# EAGLE schematic dacqs_host_board (EAGLE 7.7.0)

## Sheet 1 of 10
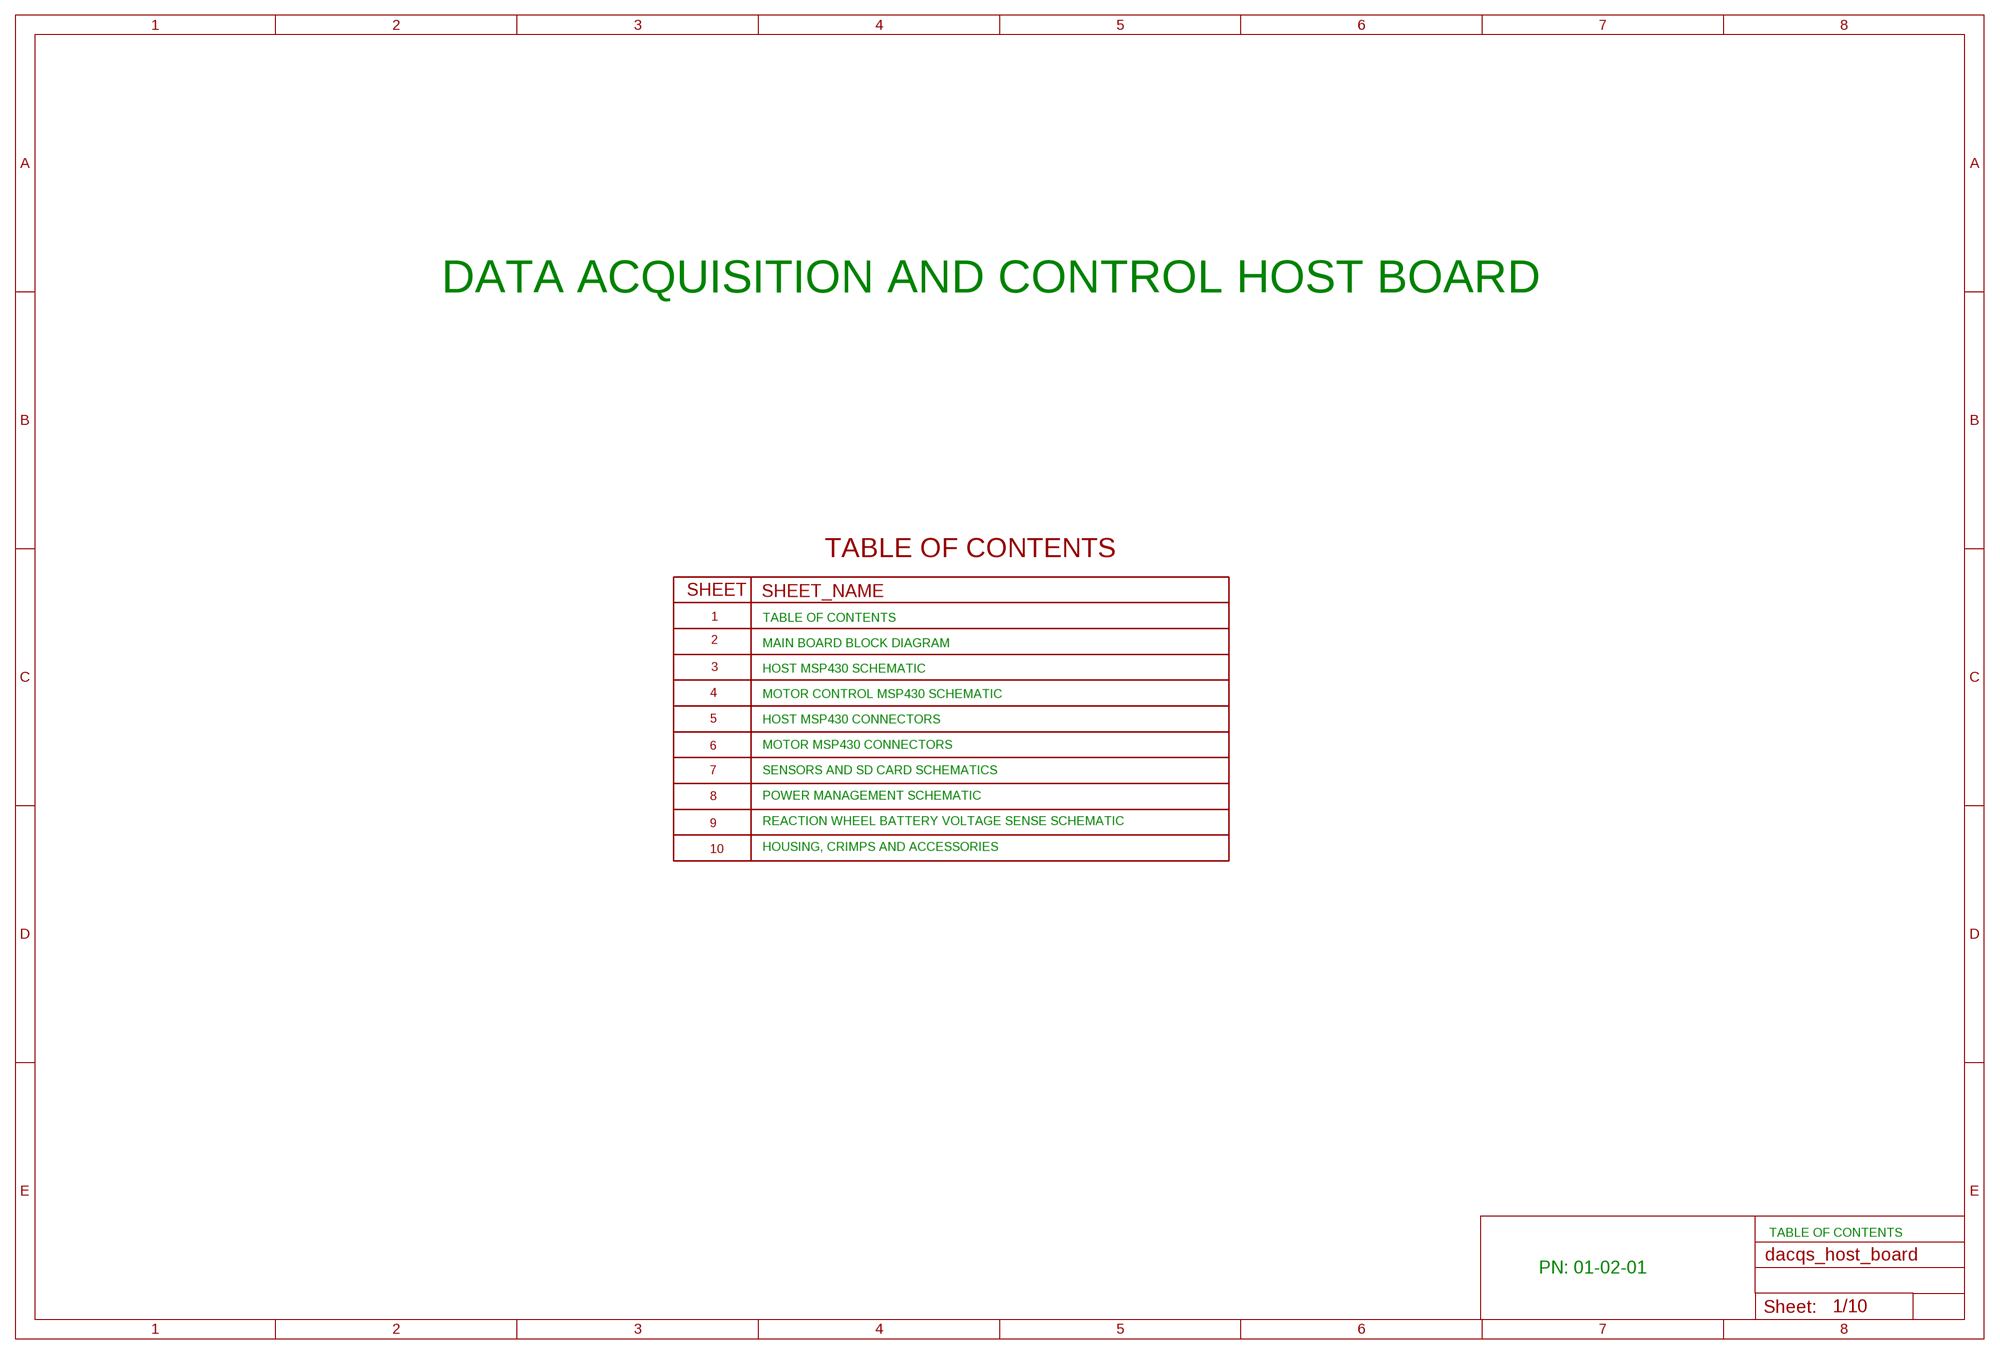
[diagram p0: schematic, sheet 1]
U$2 (TOC): VALUE: TOC

### Notes on the sheet
- DATA ACQUISITION AND CONTROL HOST BOARD
- TABLE OF CONTENTS
- MAIN BOARD BLOCK DIAGRAM
- HOST MSP430 SCHEMATIC
- MOTOR CONTROL MSP430 SCHEMATIC
- HOST MSP430 CONNECTORS
- MOTOR MSP430 CONNECTORS
- SENSORS AND SD CARD SCHEMATICS
- POWER MANAGEMENT SCHEMATIC
- REACTION WHEEL BATTERY VOLTAGE SENSE SCHEMATIC
- HOUSING, CRIMPS AND ACCESSORIES
- TABLE OF CONTENTS
- PN: 01-02-01

## Sheet 2 of 10
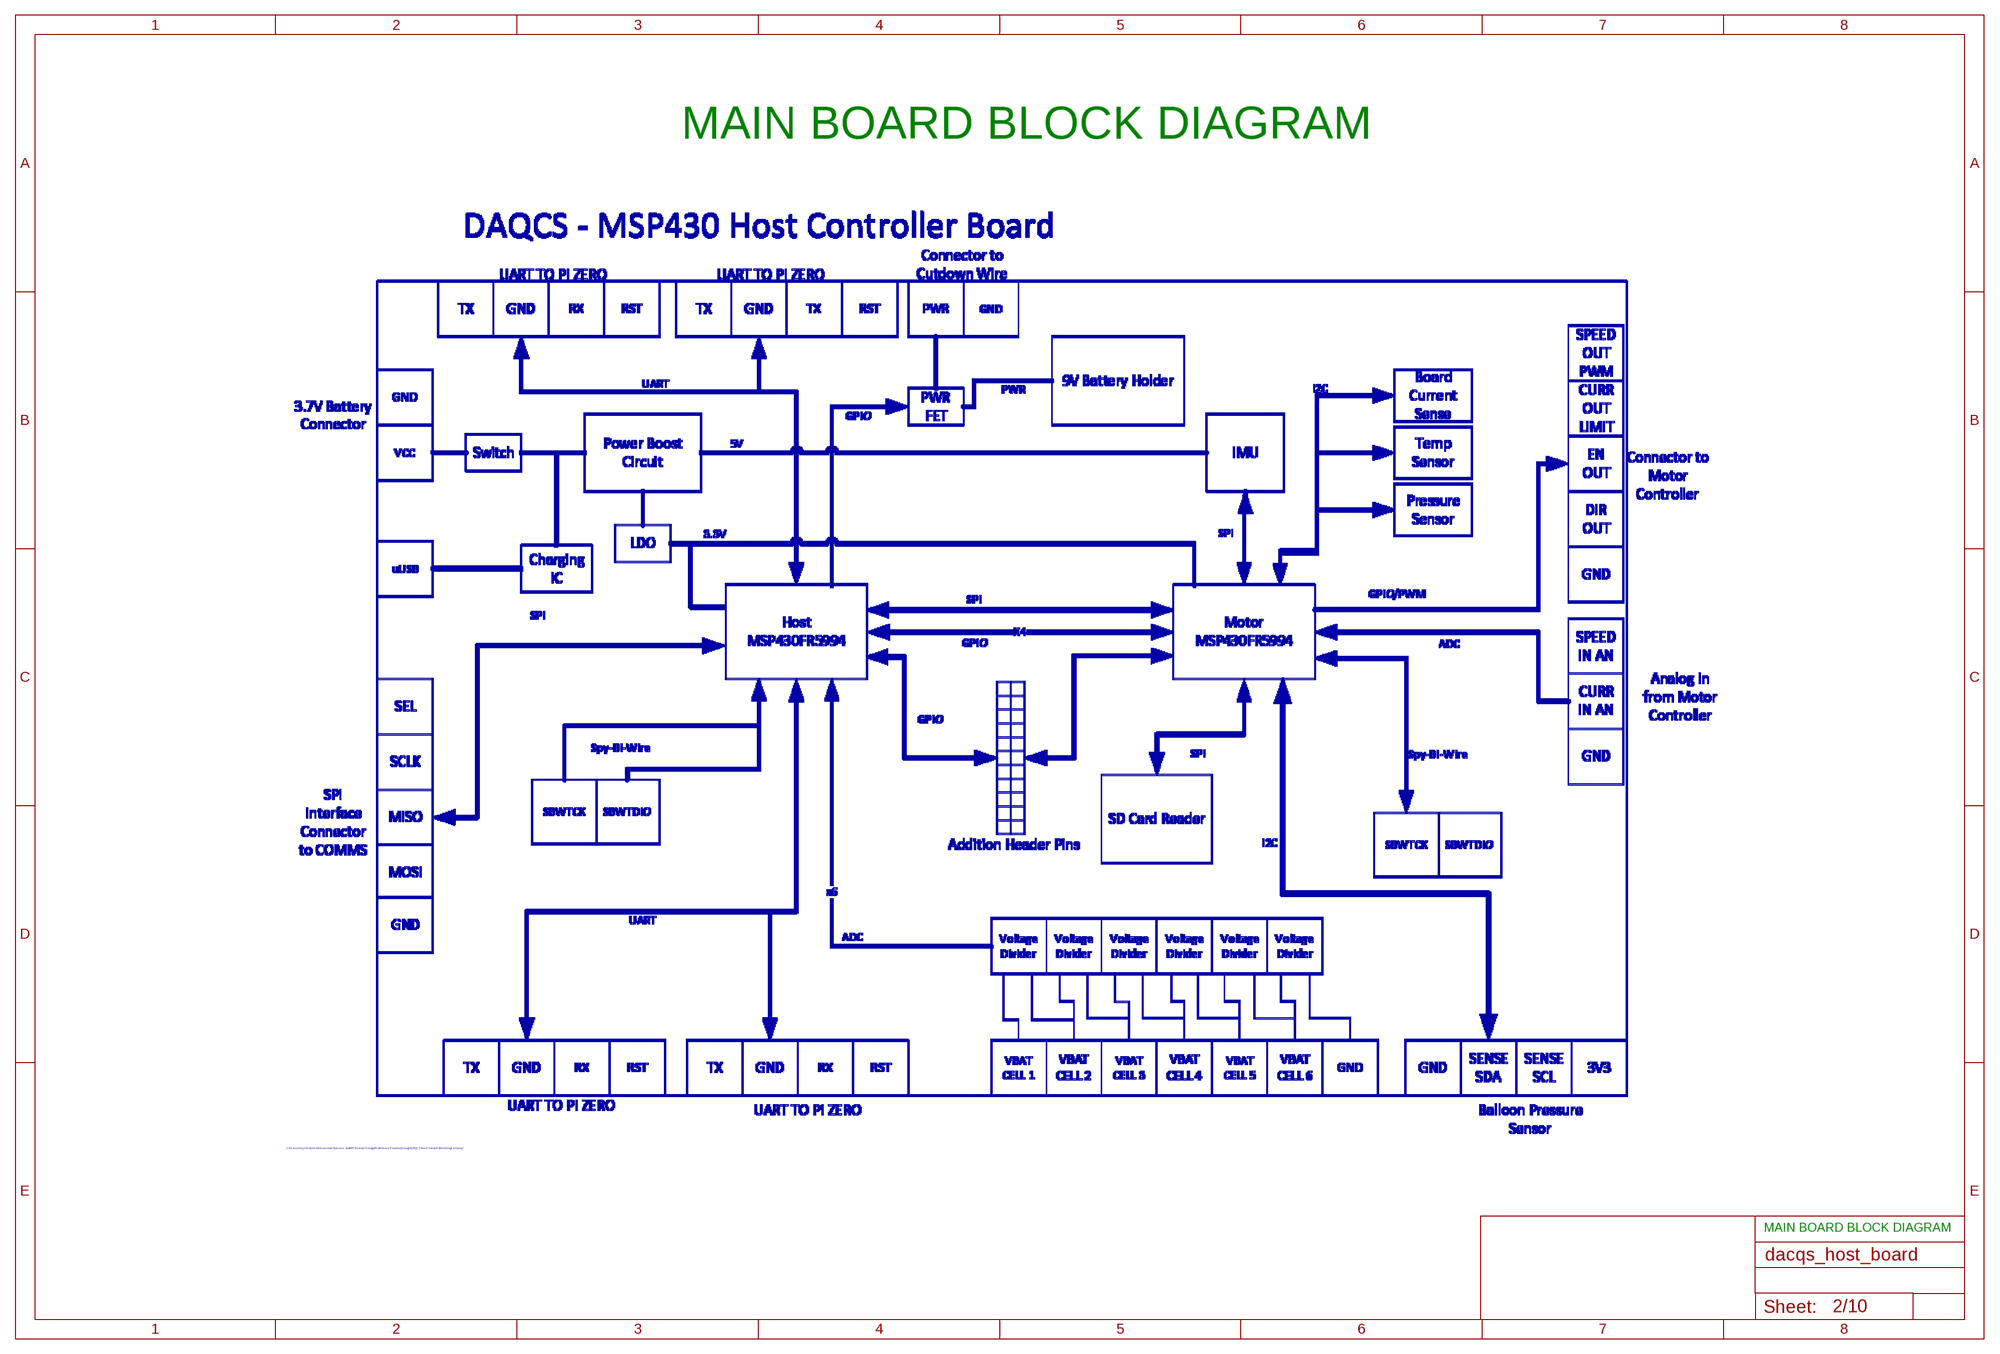
[diagram p1: schematic, sheet 2]

### Notes on the sheet
- MAIN BOARD BLOCK DIAGRAM
- MAIN BOARD BLOCK DIAGRAM

## Sheet 3 of 10
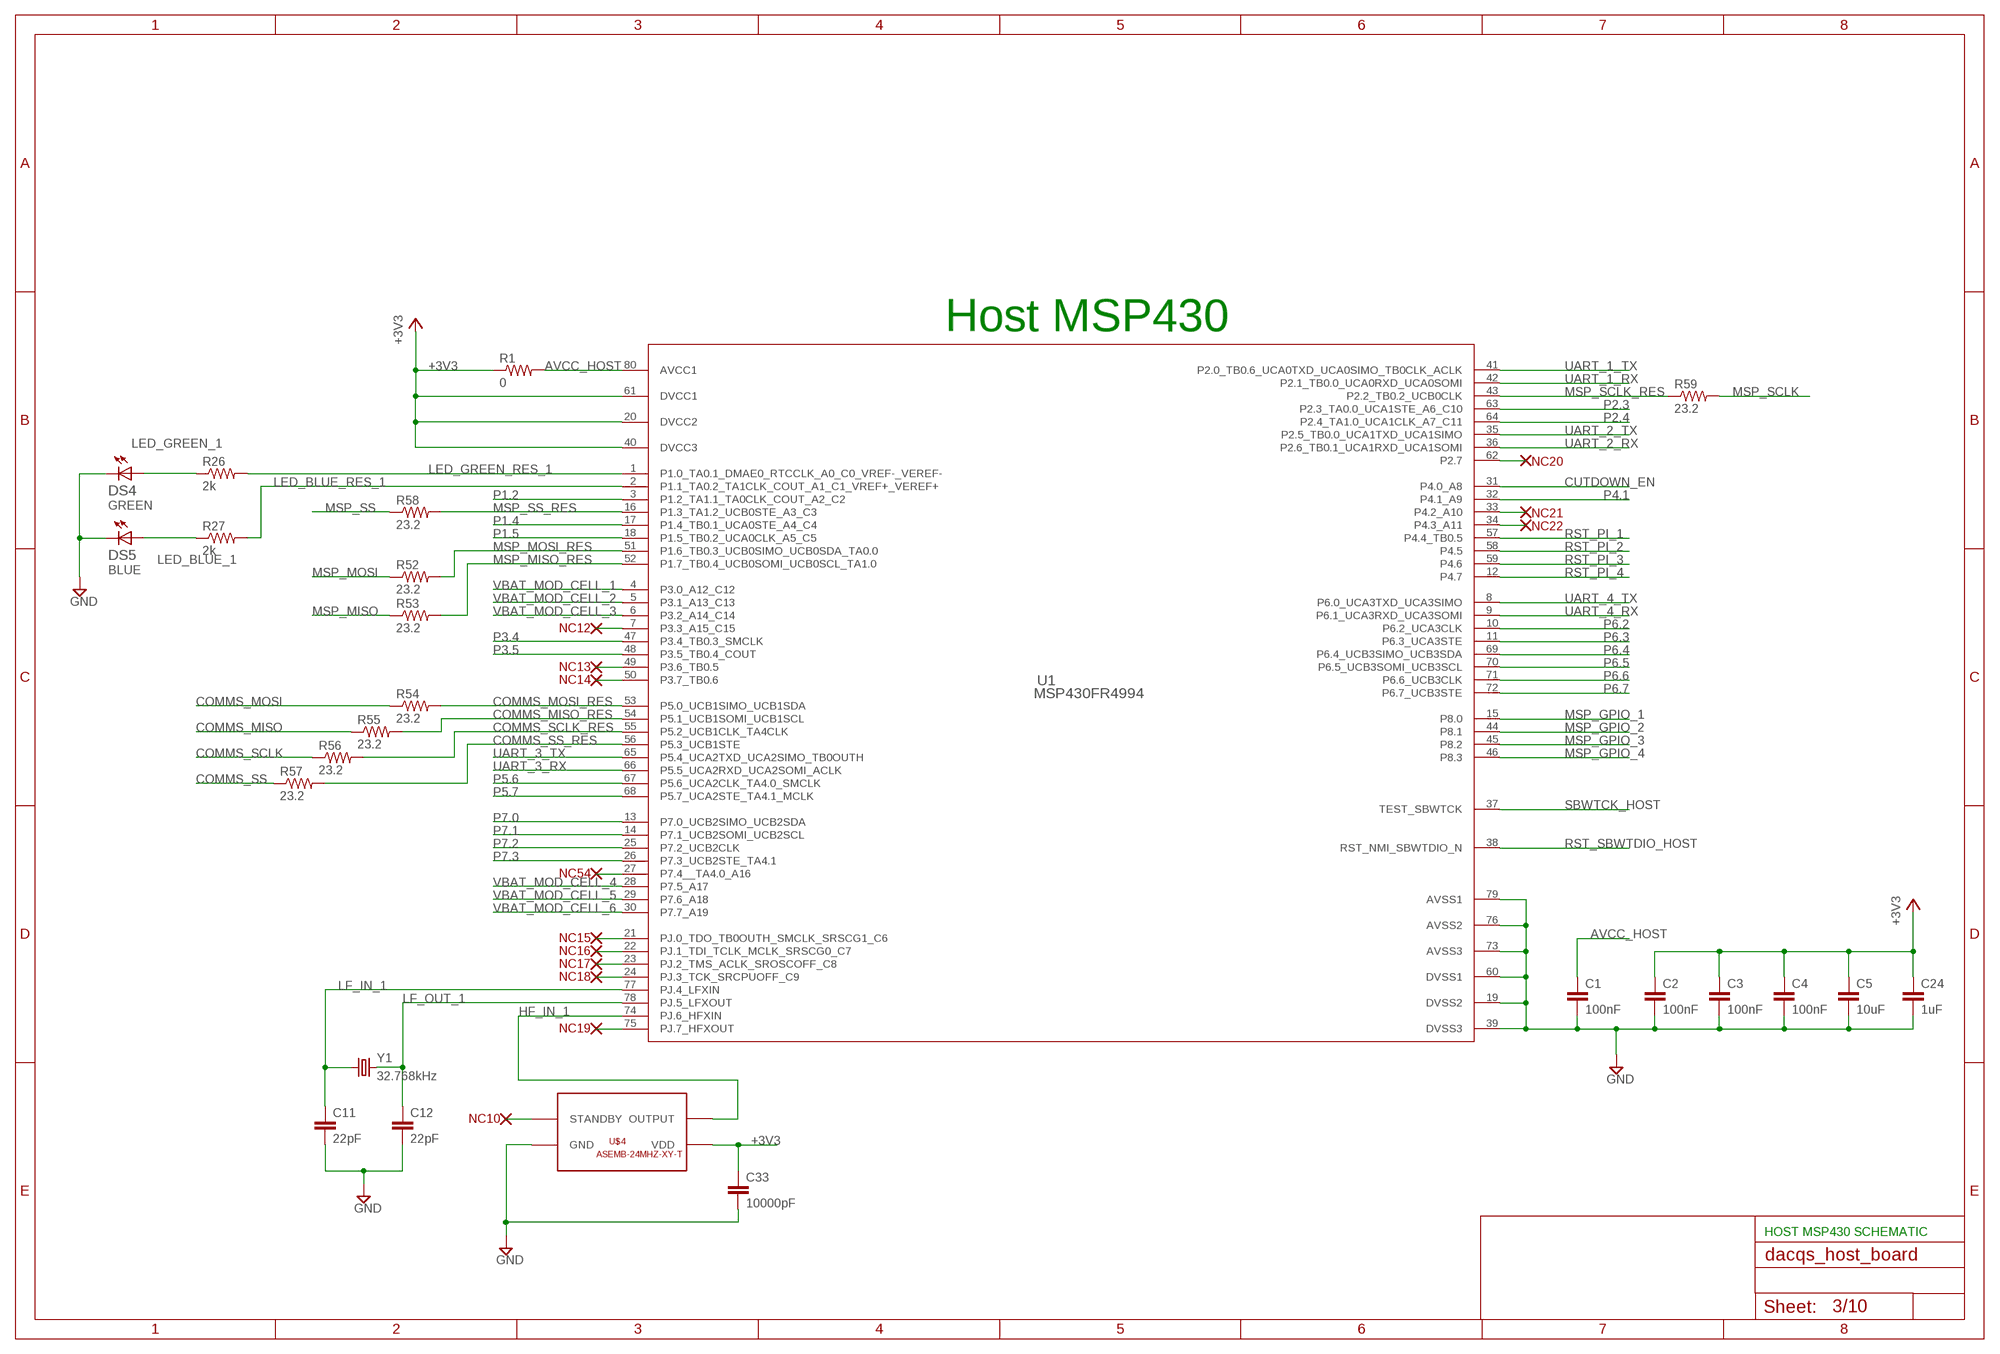
[diagram p2: schematic, sheet 3]

### Parts
C1  100nF  CAP_100NF0_0603  [C0603]
C2  100nF  CAP_100NF0_0603  [C0603]
C3  100nF  CAP_100NF0_0603  [C0603]
C4  100nF  CAP_100NF0_0603  [C0603]
C5  10uF  CAP_10UF0_0603  [C0603]
C11  22pF  CAP_22PF0_0603  [C0603]
C12  22pF  CAP_22PF0_0603  [C0603]
C24  1uF  CAP_1UF0_0603  [C0603]
C33  10000pF  CAP_10000PF0_0603  [C0603]
DS4  GREEN  LED_G3V2WURTH_0603  [LED0603]
DS5  BLUE  LED_B3V2WURTH_0603  [LED0603]
NC10  NC  NO_CONNECT  (no package)
NC12  NC  NO_CONNECT  (no package)
NC13  NC  NO_CONNECT  (no package)
NC14  NC  NO_CONNECT  (no package)
NC15  NC  NO_CONNECT  (no package)
NC16  NC  NO_CONNECT  (no package)
NC17  NC  NO_CONNECT  (no package)
NC18  NC  NO_CONNECT  (no package)
NC19  NC  NO_CONNECT  (no package)
NC20  NC  NO_CONNECT  (no package)
NC21  NC  NO_CONNECT  (no package)
NC22  NC  NO_CONNECT  (no package)
NC54  NC  NO_CONNECT  (no package)
R1  0  RES_0R0_0603  [R0603]
R26  2k  RES_2R0_0603  [R0603]
R27  2k  RES_2R0_0603  [R0603]
R52  23.2  RES_0R23S2_0603  [R0603]
R53  23.2  RES_0R23S2_0603  [R0603]
R54  23.2  RES_0R23S2_0603  [R0603]
R55  23.2  RES_0R23S2_0603  [R0603]
R56  23.2  RES_0R23S2_0603  [R0603]
R57  23.2  RES_0R23S2_0603  [R0603]
R58  23.2  RES_0R23S2_0603  [R0603]
R59  23.2  RES_0R23S2_0603  [R0603]
U1  MSP430FR4994  MSP430FR5994IPNR  [PN0080A_N]
U$4  ASEMB-24MHZ-XY-T  [ASEMB-24MHZ-XY-T-PAC]
Y1  32.768kHz  CRYSTAL3.2X1.5MM  [CRYSTAL-SMD-3.2X1.5MM]

### Nets
+3V3: C2.1 C3.1 C4.1 C5.1 C24.1 C33.1 R1.1 U1.20(DVCC2) U1.40(DVCC3) U1.61(DVCC1) U$4.P$4(VDD) ; also sheet 4,5,6,7,8,9
AVCC_HOST: C1.1 R1.2 U1.80(AVCC1)
COMMS_MISO: R55.1 ; also sheet 5
COMMS_MISO_RES: R55.2 U1.54(P5.1_UCB1SOMI_UCB1SCL)
COMMS_MOSI: R54.1 ; also sheet 5
COMMS_MOSI_RES: R54.2 U1.53(P5.0_UCB1SIMO_UCB1SDA)
COMMS_SCLK: R56.1 ; also sheet 5
COMMS_SCLK_RES: R56.2 U1.55(P5.2_UCB1CLK_TA4CLK)
COMMS_SS: R57.1 ; also sheet 5
COMMS_SS_RES: R57.2 U1.56(P5.3_UCB1STE)
CUTDOWN_EN: U1.31(P4.0_A8) ; also sheet 5
GND: C1.2 C2.2 C3.2 C4.2 C5.2 C11.2 C12.2 C24.2 C33.2 DS4.1(C) DS5.1(C) U1.19(DVSS2) U1.39(DVSS3) U1.60(DVSS1) U1.73(AVSS3) U1.76(AVSS2) U1.79(AVSS1) U$4.P$2(GND) ; also sheet 4,5,6,7,8,9
HF_IN_1: U1.74(PJ.6_HFXIN) U$4.P$3(OUTPUT)
LED_BLUE_1: DS5.2(A) R27.1
LED_BLUE_RES_1: R27.2 U1.2(P1.1_TA0.2_TA1CLK_COUT_A1_C1_VREF+_VEREF+)
LED_GREEN_1: DS4.2(A) R26.1
LED_GREEN_RES_1: R26.2 U1.1(P1.0_TA0.1_DMAE0_RTCCLK_A0_C0_VREF-_VEREF-)
LF_IN_1: C11.1 U1.77(PJ.4_LFXIN) Y1.P$1
LF_OUT_1: C12.1 U1.78(PJ.5_LFXOUT) Y1.P$2
MSP_GPIO_1: U1.15(P8.0) ; also sheet 4
MSP_GPIO_2: U1.44(P8.1) ; also sheet 4
MSP_GPIO_3: U1.45(P8.2) ; also sheet 4
MSP_GPIO_4: U1.46(P8.3) ; also sheet 4
MSP_MISO: R53.1 ; also sheet 4
MSP_MISO_RES: R53.2 U1.52(P1.7_TB0.4_UCB0SOMI_UCB0SCL_TA1.0)
MSP_MOSI: R52.1 ; also sheet 4
MSP_MOSI_RES: R52.2 U1.51(P1.6_TB0.3_UCB0SIMO_UCB0SDA_TA0.0)
MSP_SCLK: R59.2 ; also sheet 4
MSP_SCLK_RES: R59.1 U1.43(P2.2_TB0.2_UCB0CLK)
MSP_SS: R58.1 ; also sheet 4
MSP_SS_RES: R58.2 U1.16(P1.3_TA1.2_UCB0STE_A3_C3)
N$4: NC10.NC U$4.P$1(STANDBY)
N$10: NC12.NC U1.7(P3.3_A15_C15)
N$11: NC13.NC U1.49(P3.6_TB0.5)
N$12: NC14.NC U1.50(P3.7_TB0.6)
N$13: NC15.NC U1.21(PJ.0_TDO_TB0OUTH_SMCLK_SRSCG1_C6)
N$14: NC16.NC U1.22(PJ.1_TDI_TCLK_MCLK_SRSCG0_C7)
N$15: NC17.NC U1.23(PJ.2_TMS_ACLK_SROSCOFF_C8)
N$16: NC18.NC U1.24(PJ.3_TCK_SRCPUOFF_C9)
N$17: NC19.NC U1.75(PJ.7_HFXOUT)
N$18: NC20.NC U1.62(P2.7)
N$19: NC21.NC U1.33(P4.2_A10)
N$20: NC22.NC U1.34(P4.3_A11)
N$60: NC54.NC U1.27(P7.4__TA4.0_A16)
P1.2: U1.3(P1.2_TA1.1_TA0CLK_COUT_A2_C2) ; also sheet 9
P1.4: U1.17(P1.4_TB0.1_UCA0STE_A4_C4) ; also sheet 9
P1.5: U1.18(P1.5_TB0.2_UCA0CLK_A5_C5) ; also sheet 9
P2.3: U1.63(P2.3_TA0.0_UCA1STE_A6_C10)
P2.4: U1.64(P2.4_TA1.0_UCA1CLK_A7_C11)
P3.4: U1.47(P3.4_TB0.3_SMCLK)
P3.5: U1.48(P3.5_TB0.4_COUT)
P4.1: U1.32(P4.1_A9)
P5.6: U1.67(P5.6_UCA2CLK_TA4.0_SMCLK)
P5.7: U1.68(P5.7_UCA2STE_TA4.1_MCLK)
P6.2: U1.10(P6.2_UCA3CLK) ; also sheet 9
P6.3: U1.11(P6.3_UCA3STE) ; also sheet 9
P6.4: U1.69(P6.4_UCB3SIMO_UCB3SDA) ; also sheet 9
P6.5: U1.70(P6.5_UCB3SOMI_UCB3SCL) ; also sheet 9
P6.6: U1.71(P6.6_UCB3CLK) ; also sheet 9
P6.7: U1.72(P6.7_UCB3STE) ; also sheet 9
P7.0: U1.13(P7.0_UCB2SIMO_UCB2SDA) ; also sheet 9
P7.1: U1.14(P7.1_UCB2SOMI_UCB2SCL) ; also sheet 9
P7.2: U1.25(P7.2_UCB2CLK) ; also sheet 9
P7.3: U1.26(P7.3_UCB2STE_TA4.1) ; also sheet 9
RST_PI_1: U1.57(P4.4_TB0.5) ; also sheet 5
RST_PI_2: U1.58(P4.5) ; also sheet 5
RST_PI_3: U1.59(P4.6) ; also sheet 5
RST_PI_4: U1.12(P4.7) ; also sheet 5
RST_SBWTDIO_HOST: U1.38(RST_NMI_SBWTDIO_N) ; also sheet 5
SBWTCK_HOST: U1.37(TEST_SBWTCK) ; also sheet 5
UART_1_RX: U1.42(P2.1_TB0.0_UCA0RXD_UCA0SOMI) ; also sheet 5
UART_1_TX: U1.41(P2.0_TB0.6_UCA0TXD_UCA0SIMO_TB0CLK_ACLK) ; also sheet 5
UART_2_RX: U1.36(P2.6_TB0.1_UCA1RXD_UCA1SOMI) ; also sheet 5
UART_2_TX: U1.35(P2.5_TB0.0_UCA1TXD_UCA1SIMO) ; also sheet 5
UART_3_RX: U1.66(P5.5_UCA2RXD_UCA2SOMI_ACLK) ; also sheet 5
UART_3_TX: U1.65(P5.4_UCA2TXD_UCA2SIMO_TB0OUTH) ; also sheet 5
UART_4_RX: U1.9(P6.1_UCA3RXD_UCA3SOMI) ; also sheet 5
UART_4_TX: U1.8(P6.0_UCA3TXD_UCA3SIMO) ; also sheet 5
VBAT_MOD_CELL_1: U1.4(P3.0_A12_C12) ; also sheet 9
VBAT_MOD_CELL_2: U1.5(P3.1_A13_C13) ; also sheet 9
VBAT_MOD_CELL_3: U1.6(P3.2_A14_C14) ; also sheet 9
VBAT_MOD_CELL_4: U1.28(P7.5_A17) ; also sheet 9
VBAT_MOD_CELL_5: U1.29(P7.6_A18) ; also sheet 9
VBAT_MOD_CELL_6: U1.30(P7.7_A19) ; also sheet 9

### Notes on the sheet
- Host MSP430
- HOST MSP430 SCHEMATIC

## Sheet 4 of 10
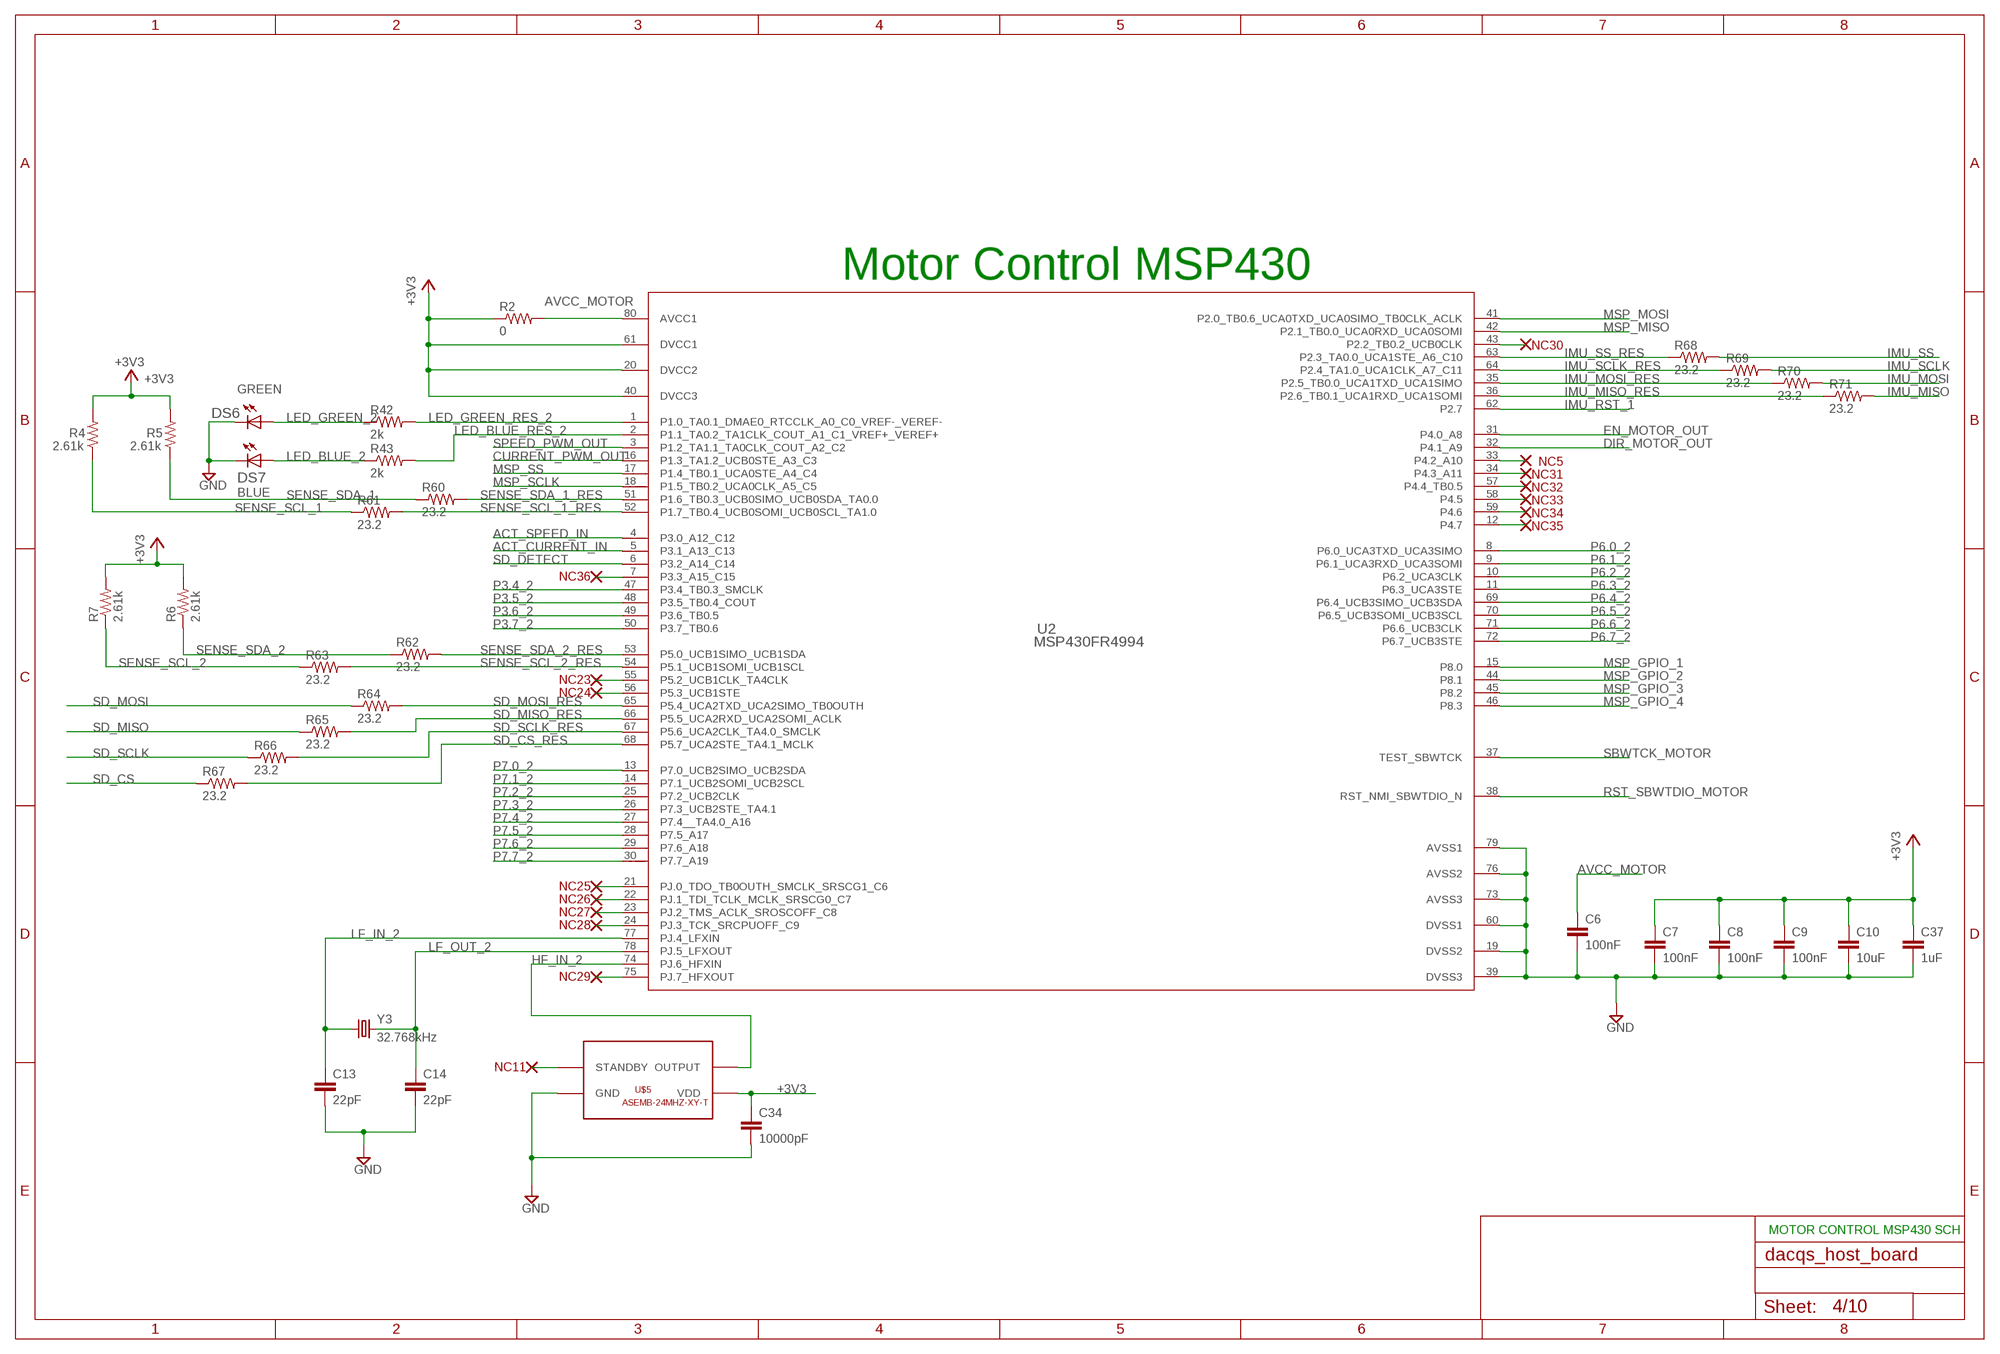
[diagram p3: schematic, sheet 4]

### Parts
C6  100nF  CAP_100NF0_0603  [C0603]
C7  100nF  CAP_100NF0_0603  [C0603]
C8  100nF  CAP_100NF0_0603  [C0603]
C9  100nF  CAP_100NF0_0603  [C0603]
C10  10uF  CAP_10UF0_0603  [C0603]
C13  22pF  CAP_22PF0_0603  [C0603]
C14  22pF  CAP_22PF0_0603  [C0603]
C34  10000pF  CAP_10000PF0_0603  [C0603]
C37  1uF  CAP_1UF0_0603  [C0603]
DS6  GREEN  LED_G3V2WURTH_0603  [LED0603]
DS7  BLUE  LED_B3V2WURTH_0603  [LED0603]
NC5  NC  NO_CONNECT  (no package)
NC11  NC  NO_CONNECT  (no package)
NC23  NC  NO_CONNECT  (no package)
NC24  NC  NO_CONNECT  (no package)
NC25  NC  NO_CONNECT  (no package)
NC26  NC  NO_CONNECT  (no package)
NC27  NC  NO_CONNECT  (no package)
NC28  NC  NO_CONNECT  (no package)
NC29  NC  NO_CONNECT  (no package)
NC30  NC  NO_CONNECT  (no package)
NC31  NC  NO_CONNECT  (no package)
NC32  NC  NO_CONNECT  (no package)
NC33  NC  NO_CONNECT  (no package)
NC34  NC  NO_CONNECT  (no package)
NC35  NC  NO_CONNECT  (no package)
NC36  NC  NO_CONNECT  (no package)
R2  0  RES_0R0_0603  [R0603]
R4  2.61k  RES_2R61_0603  [R0603]
R5  2.61k  RES_2R61_0603  [R0603]
R6  2.61k  RES_2R61_0603  [R0603]
R7  2.61k  RES_2R61_0603  [R0603]
R42  2k  RES_2R0_0603  [R0603]
R43  2k  RES_2R0_0603  [R0603]
R60  23.2  RES_0R23S2_0603  [R0603]
R61  23.2  RES_0R23S2_0603  [R0603]
R62  23.2  RES_0R23S2_0603  [R0603]
R63  23.2  RES_0R23S2_0603  [R0603]
R64  23.2  RES_0R23S2_0603  [R0603]
R65  23.2  RES_0R23S2_0603  [R0603]
R66  23.2  RES_0R23S2_0603  [R0603]
R67  23.2  RES_0R23S2_0603  [R0603]
R68  23.2  RES_0R23S2_0603  [R0603]
R69  23.2  RES_0R23S2_0603  [R0603]
R70  23.2  RES_0R23S2_0603  [R0603]
R71  23.2  RES_0R23S2_0603  [R0603]
U2  MSP430FR4994  MSP430FR5994IPNR  [PN0080A_N]
U$5  ASEMB-24MHZ-XY-T  [ASEMB-24MHZ-XY-T-PAC]
Y3  32.768kHz  CRYSTAL3.2X1.5MM  [CRYSTAL-SMD-3.2X1.5MM]

### Nets
+3V3: C7.1 C8.1 C9.1 C10.1 C34.1 C37.1 R2.1 R4.2 R5.2 R6.2 R7.2 U2.20(DVCC2) U2.40(DVCC3) U2.61(DVCC1) U$5.P$4(VDD) ; also sheet 3,5,6,7,8,9
ACT_CURRENT_IN: U2.5(P3.1_A13_C13) ; also sheet 6
ACT_SPEED_IN: U2.4(P3.0_A12_C12) ; also sheet 6
AVCC_MOTOR: C6.1 R2.2 U2.80(AVCC1)
CURRENT_PWM_OUT: U2.16(P1.3_TA1.2_UCB0STE_A3_C3) ; also sheet 6
DIR_MOTOR_OUT: U2.32(P4.1_A9) ; also sheet 6
EN_MOTOR_OUT: U2.31(P4.0_A8) ; also sheet 6
GND: C6.2 C7.2 C8.2 C9.2 C10.2 C13.2 C14.2 C34.2 C37.2 DS6.1(C) DS7.1(C) U2.19(DVSS2) U2.39(DVSS3) U2.60(DVSS1) U2.73(AVSS3) U2.76(AVSS2) U2.79(AVSS1) U$5.P$2(GND) ; also sheet 3,5,6,7,8,9
HF_IN_2: U2.74(PJ.6_HFXIN) U$5.P$3(OUTPUT)
IMU_MISO: R71.2 ; also sheet 7
IMU_MISO_RES: R71.1 U2.36(P2.6_TB0.1_UCA1RXD_UCA1SOMI)
IMU_MOSI: R70.2 ; also sheet 7
IMU_MOSI_RES: R70.1 U2.35(P2.5_TB0.0_UCA1TXD_UCA1SIMO)
IMU_RST_1: U2.62(P2.7) ; also sheet 7
IMU_SCLK: R69.2 ; also sheet 7
IMU_SCLK_RES: R69.1 U2.64(P2.4_TA1.0_UCA1CLK_A7_C11)
IMU_SS: R68.2 ; also sheet 7
IMU_SS_RES: R68.1 U2.63(P2.3_TA0.0_UCA1STE_A6_C10)
LED_BLUE_2: DS7.2(A) R43.1
LED_BLUE_RES_2: R43.2 U2.2(P1.1_TA0.2_TA1CLK_COUT_A1_C1_VREF+_VEREF+)
LED_GREEN_2: DS6.2(A) R42.1
LED_GREEN_RES_2: R42.2 U2.1(P1.0_TA0.1_DMAE0_RTCCLK_A0_C0_VREF-_VEREF-)
LF_IN_2: C13.1 U2.77(PJ.4_LFXIN) Y3.P$1
LF_OUT_2: C14.1 U2.78(PJ.5_LFXOUT) Y3.P$2
MSP_GPIO_1: U2.15(P8.0) ; also sheet 3
MSP_GPIO_2: U2.44(P8.1) ; also sheet 3
MSP_GPIO_3: U2.45(P8.2) ; also sheet 3
MSP_GPIO_4: U2.46(P8.3) ; also sheet 3
MSP_MISO: U2.42(P2.1_TB0.0_UCA0RXD_UCA0SOMI) ; also sheet 3
MSP_MOSI: U2.41(P2.0_TB0.6_UCA0TXD_UCA0SIMO_TB0CLK_ACLK) ; also sheet 3
MSP_SCLK: U2.18(P1.5_TB0.2_UCA0CLK_A5_C5) ; also sheet 3
MSP_SS: U2.17(P1.4_TB0.1_UCA0STE_A4_C4) ; also sheet 3
N$5: NC11.NC U$5.P$1(STANDBY)
N$6: NC5.NC U2.33(P4.2_A10)
N$21: NC36.NC U2.7(P3.3_A15_C15)
N$24: NC23.NC U2.55(P5.2_UCB1CLK_TA4CLK)
N$25: NC24.NC U2.56(P5.3_UCB1STE)
N$26: NC25.NC U2.21(PJ.0_TDO_TB0OUTH_SMCLK_SRSCG1_C6)
N$31: NC26.NC U2.22(PJ.1_TDI_TCLK_MCLK_SRSCG0_C7)
N$32: NC27.NC U2.23(PJ.2_TMS_ACLK_SROSCOFF_C8)
N$33: NC28.NC U2.24(PJ.3_TCK_SRCPUOFF_C9)
N$34: NC29.NC U2.75(PJ.7_HFXOUT)
N$35: NC30.NC U2.43(P2.2_TB0.2_UCB0CLK)
N$36: NC31.NC U2.34(P4.3_A11)
N$38: NC32.NC U2.57(P4.4_TB0.5)
N$39: NC33.NC U2.58(P4.5)
N$40: NC34.NC U2.59(P4.6)
N$41: NC35.NC U2.12(P4.7)
P3.4_2: U2.47(P3.4_TB0.3_SMCLK) ; also sheet 9
P3.5_2: U2.48(P3.5_TB0.4_COUT) ; also sheet 9
P3.6_2: U2.49(P3.6_TB0.5) ; also sheet 9
P3.7_2: U2.50(P3.7_TB0.6) ; also sheet 9
P6.0_2: U2.8(P6.0_UCA3TXD_UCA3SIMO) ; also sheet 9
P6.1_2: U2.9(P6.1_UCA3RXD_UCA3SOMI) ; also sheet 9
P6.2_2: U2.10(P6.2_UCA3CLK) ; also sheet 9
P6.3_2: U2.11(P6.3_UCA3STE) ; also sheet 9
P6.4_2: U2.69(P6.4_UCB3SIMO_UCB3SDA)
P6.5_2: U2.70(P6.5_UCB3SOMI_UCB3SCL) ; also sheet 9
P6.6_2: U2.71(P6.6_UCB3CLK) ; also sheet 9
P6.7_2: U2.72(P6.7_UCB3STE) ; also sheet 9
P7.0_2: U2.13(P7.0_UCB2SIMO_UCB2SDA) ; also sheet 9
P7.1_2: U2.14(P7.1_UCB2SOMI_UCB2SCL) ; also sheet 9
P7.2_2: U2.25(P7.2_UCB2CLK) ; also sheet 9
P7.3_2: U2.26(P7.3_UCB2STE_TA4.1) ; also sheet 9
P7.4_2: U2.27(P7.4__TA4.0_A16) ; also sheet 9
P7.5_2: U2.28(P7.5_A17) ; also sheet 9
P7.6_2: U2.29(P7.6_A18) ; also sheet 9
P7.7_2: U2.30(P7.7_A19) ; also sheet 9
RST_SBWTDIO_MOTOR: U2.38(RST_NMI_SBWTDIO_N) ; also sheet 6
SBWTCK_MOTOR: U2.37(TEST_SBWTCK) ; also sheet 6
SD_CS: R67.1 ; also sheet 7
SD_CS_RES: R67.2 U2.68(P5.7_UCA2STE_TA4.1_MCLK)
SD_DETECT: U2.6(P3.2_A14_C14) ; also sheet 7
SD_MISO: R65.1 ; also sheet 7
SD_MISO_RES: R65.2 U2.66(P5.5_UCA2RXD_UCA2SOMI_ACLK)
SD_MOSI: R64.1 ; also sheet 7
SD_MOSI_RES: R64.2 U2.65(P5.4_UCA2TXD_UCA2SIMO_TB0OUTH)
SD_SCLK: R66.1 ; also sheet 7
SD_SCLK_RES: R66.2 U2.67(P5.6_UCA2CLK_TA4.0_SMCLK)
SENSE_SCL_1: R4.1 R61.1 ; also sheet 7,8
SENSE_SCL_1_RES: R61.2 U2.52(P1.7_TB0.4_UCB0SOMI_UCB0SCL_TA1.0)
SENSE_SCL_2: R7.1 R63.1 ; also sheet 6
SENSE_SCL_2_RES: R63.2 U2.54(P5.1_UCB1SOMI_UCB1SCL)
SENSE_SDA_1: R5.1 R60.1 ; also sheet 7,8
SENSE_SDA_1_RES: R60.2 U2.51(P1.6_TB0.3_UCB0SIMO_UCB0SDA_TA0.0)
SENSE_SDA_2: R6.1 R62.1 ; also sheet 6
SENSE_SDA_2_RES: R62.2 U2.53(P5.0_UCB1SIMO_UCB1SDA)
SPEED_PWM_OUT: U2.3(P1.2_TA1.1_TA0CLK_COUT_A2_C2) ; also sheet 6

### Notes on the sheet
- Motor Control MSP430
- MOTOR CONTROL MSP430 SCH

## Sheet 5 of 10
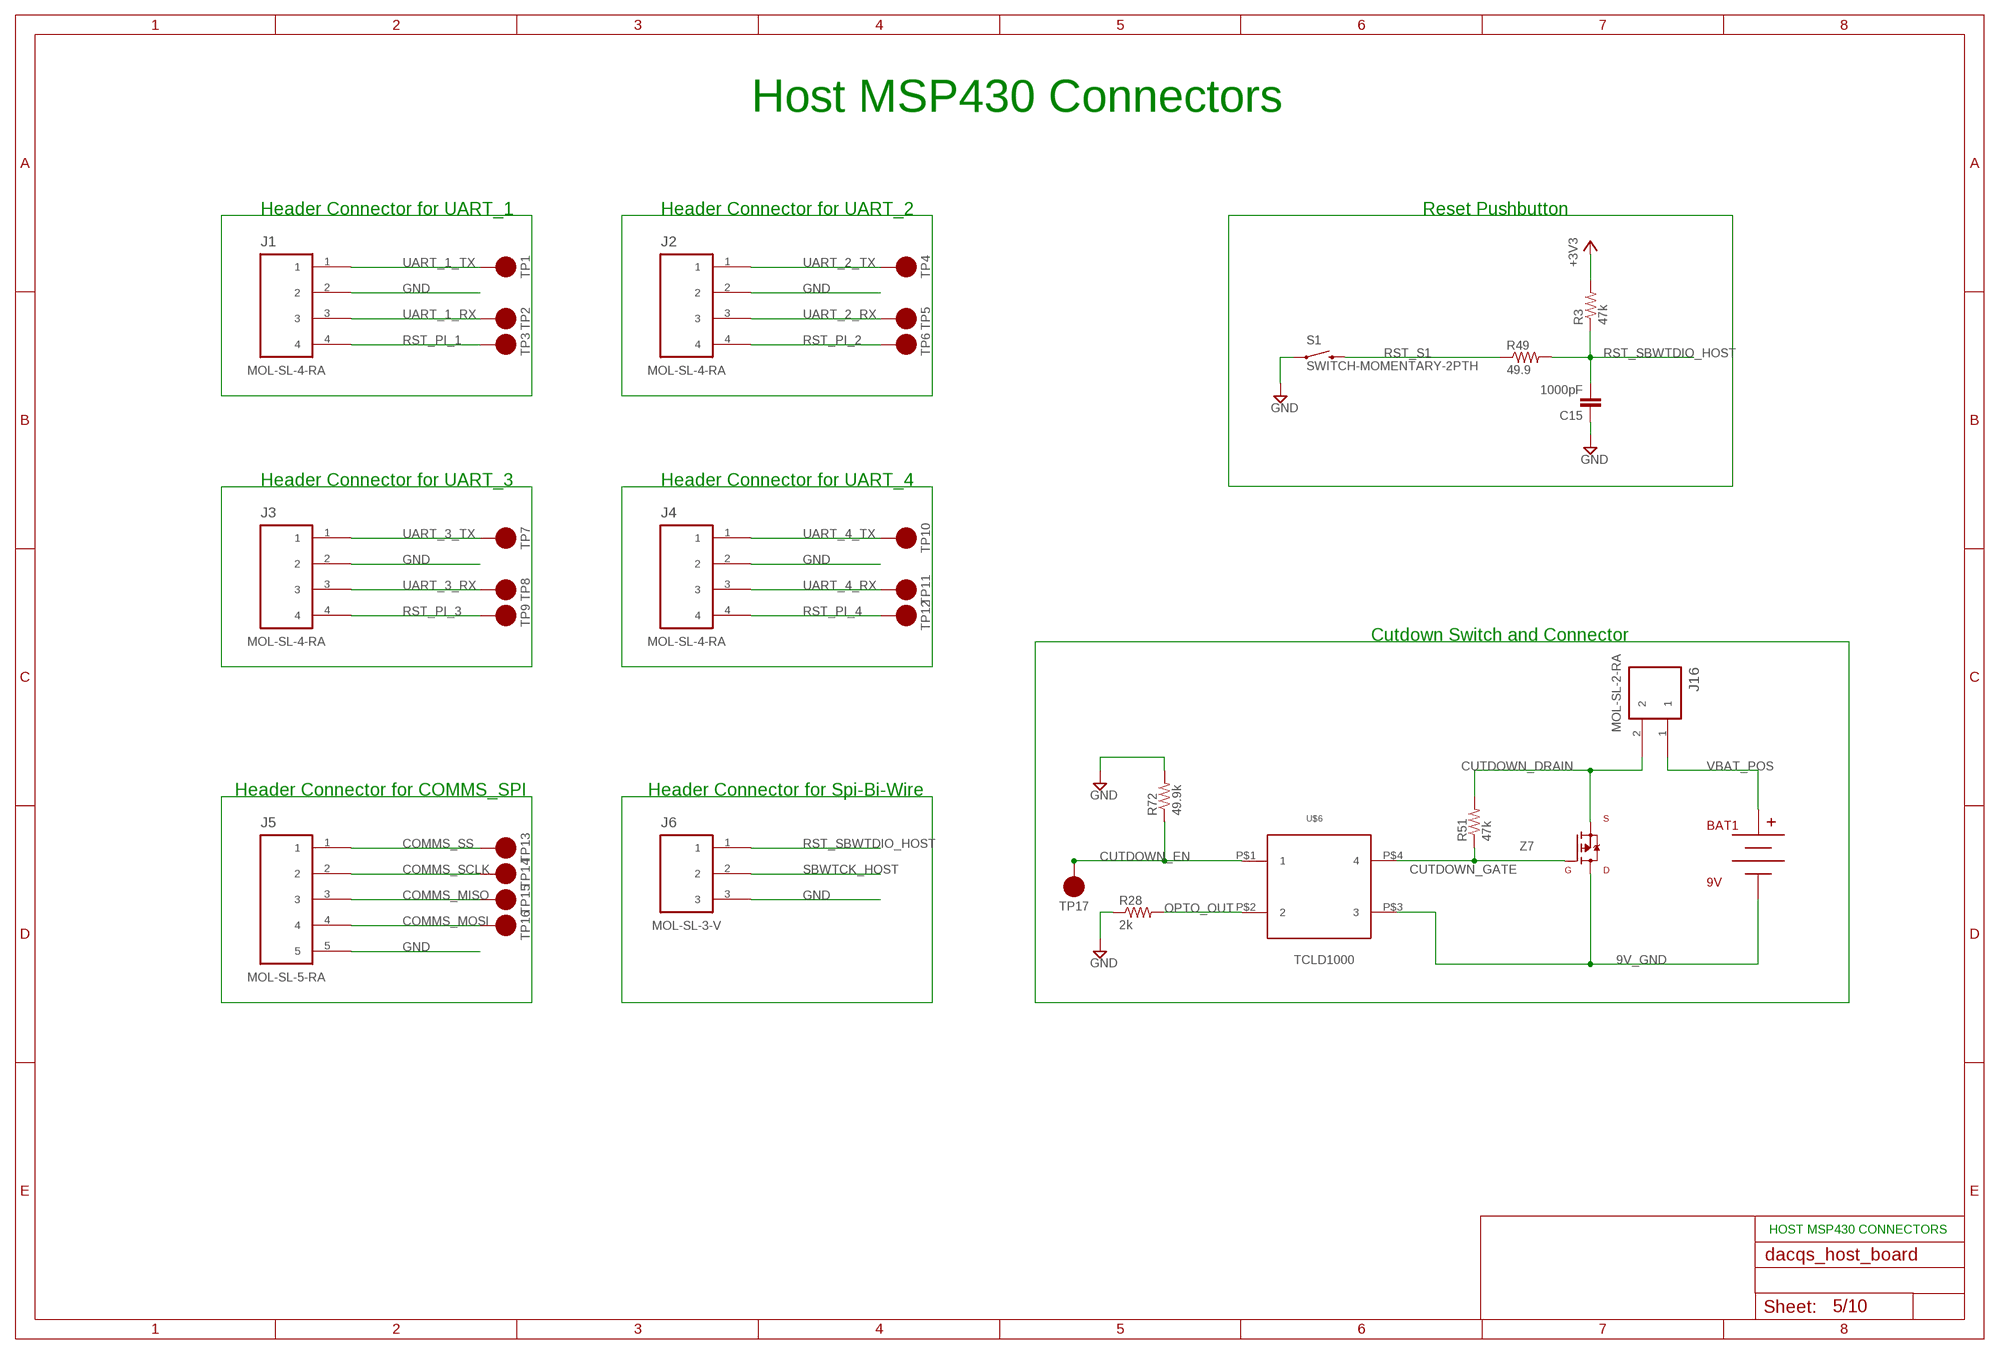
[diagram p4: schematic, sheet 5]

### Parts
BAT1  9V  BC9VPC  [BC9VPC]
C15  1000pF  CAP_1000PF0_0603  [C0603]
J1  MOL-SL-4-RA  MOLSL_4PIN_SL4RA_RA  [MOLSL-4-RA]
J2  MOL-SL-4-RA  MOLSL_4PIN_SL4RA_RA  [MOLSL-4-RA]
J3  MOL-SL-4-RA  MOLSL_4PIN_SL4RA_RA  [MOLSL-4-RA]
J4  MOL-SL-4-RA  MOLSL_4PIN_SL4RA_RA  [MOLSL-4-RA]
J5  MOL-SL-5-RA  MOLSL_5PIN_SL4RA_RA  [MOLSL-5-RA]
J6  MOL-SL-3-V  MOLSL_3PIN_SL3V_V  [MOLSL-3-V]
J16  MOL-SL-2-RA  MOLSL_2PIN_SL2RA_RA  [MOLSL-2-RA]
R3  47k  RES_47R0_0603  [R0603]
R28  2k  RES_2R0_0603  [R0603]
R49  49.9  RES_0R499_0603  [R0603]
R51  47k  RES_47R0_0603  [R0603]
R72  49.9k  RES_49R9_0603  [R0603]
S1  SWITCH-MOMENTARY-2PTH  [TACTILE-PTH]
TP1  TEST_POINT_TP10R_SMD_10R_SMD  [TP10R]
TP2  TEST_POINT_TP10R_SMD_10R_SMD  [TP10R]
TP3  TEST_POINT_TP10R_SMD_10R_SMD  [TP10R]
TP4  TEST_POINT_TP10R_SMD_10R_SMD  [TP10R]
TP5  TEST_POINT_TP10R_SMD_10R_SMD  [TP10R]
TP6  TEST_POINT_TP10R_SMD_10R_SMD  [TP10R]
TP7  TEST_POINT_TP10R_SMD_10R_SMD  [TP10R]
TP8  TEST_POINT_TP10R_SMD_10R_SMD  [TP10R]
TP9  TEST_POINT_TP10R_SMD_10R_SMD  [TP10R]
TP10  TEST_POINT_TP10R_SMD_10R_SMD  [TP10R]
TP11  TEST_POINT_TP10R_SMD_10R_SMD  [TP10R]
TP12  TEST_POINT_TP10R_SMD_10R_SMD  [TP10R]
TP13  TEST_POINT_TP10R_SMD_10R_SMD  [TP10R]
TP14  TEST_POINT_TP10R_SMD_10R_SMD  [TP10R]
TP15  TEST_POINT_TP10R_SMD_10R_SMD  [TP10R]
TP16  TEST_POINT_TP10R_SMD_10R_SMD  [TP10R]
TP17  TEST_POINT_TP10R_SMD_10R_SMD  [TP10R]
U$6  TCLD1000  [TCLD1000]
Z7  NTD2955T4G  [NTD2955T4G]

### Nets
9V_GND: BAT1.V- U$6.P$3 Z7.P$3(D)
+3V3: R3.2 ; also sheet 3,4,6,7,8,9
COMMS_MISO: J5.3 TP15.TP ; also sheet 3
COMMS_MOSI: J5.4 TP16.TP ; also sheet 3
COMMS_SCLK: J5.2 TP14.TP ; also sheet 3
COMMS_SS: J5.1 TP13.TP ; also sheet 3
CUTDOWN_DRAIN: J16.2 R51.2 Z7.P$2(S)
CUTDOWN_EN: R72.1 TP17.TP U$6.P$1 ; also sheet 3
CUTDOWN_GATE: R51.1 U$6.P$4 Z7.P$1(G)
GND: C15.1 J1.2 J2.2 J3.2 J4.2 J5.5 J6.3 R28.1 R72.2 S1.1 ; also sheet 3,4,6,7,8,9
OPTO_OUT: R28.2 U$6.P$2
RST_PI_1: J1.4 TP3.TP ; also sheet 3
RST_PI_2: J2.4 TP6.TP ; also sheet 3
RST_PI_3: J3.4 TP9.TP ; also sheet 3
RST_PI_4: J4.4 TP12.TP ; also sheet 3
RST_S1: R49.1 S1.3
RST_SBWTDIO_HOST: C15.2 J6.1 R3.1 R49.2 ; also sheet 3
SBWTCK_HOST: J6.2 ; also sheet 3
UART_1_RX: J1.3 TP2.TP ; also sheet 3
UART_1_TX: J1.1 TP1.TP ; also sheet 3
UART_2_RX: J2.3 TP5.TP ; also sheet 3
UART_2_TX: J2.1 TP4.TP ; also sheet 3
UART_3_RX: J3.3 TP8.TP ; also sheet 3
UART_3_TX: J3.1 TP7.TP ; also sheet 3
UART_4_RX: J4.3 TP11.TP ; also sheet 3
UART_4_TX: J4.1 TP10.TP ; also sheet 3
VBAT_POS: BAT1.V+ J16.1

### Notes on the sheet
- Host MSP430 Connectors
- Header Connector for UART_1 | Header Connector for UART_2 | Reset Pushbutton
- Header Connector for UART_3 | Header Connector for UART_4
- Cutdown Switch and Connector
- Header Connector for COMMS_SPI | Header Connector for Spi-Bi-Wire
- HOST MSP430 CONNECTORS

## Sheet 6 of 10
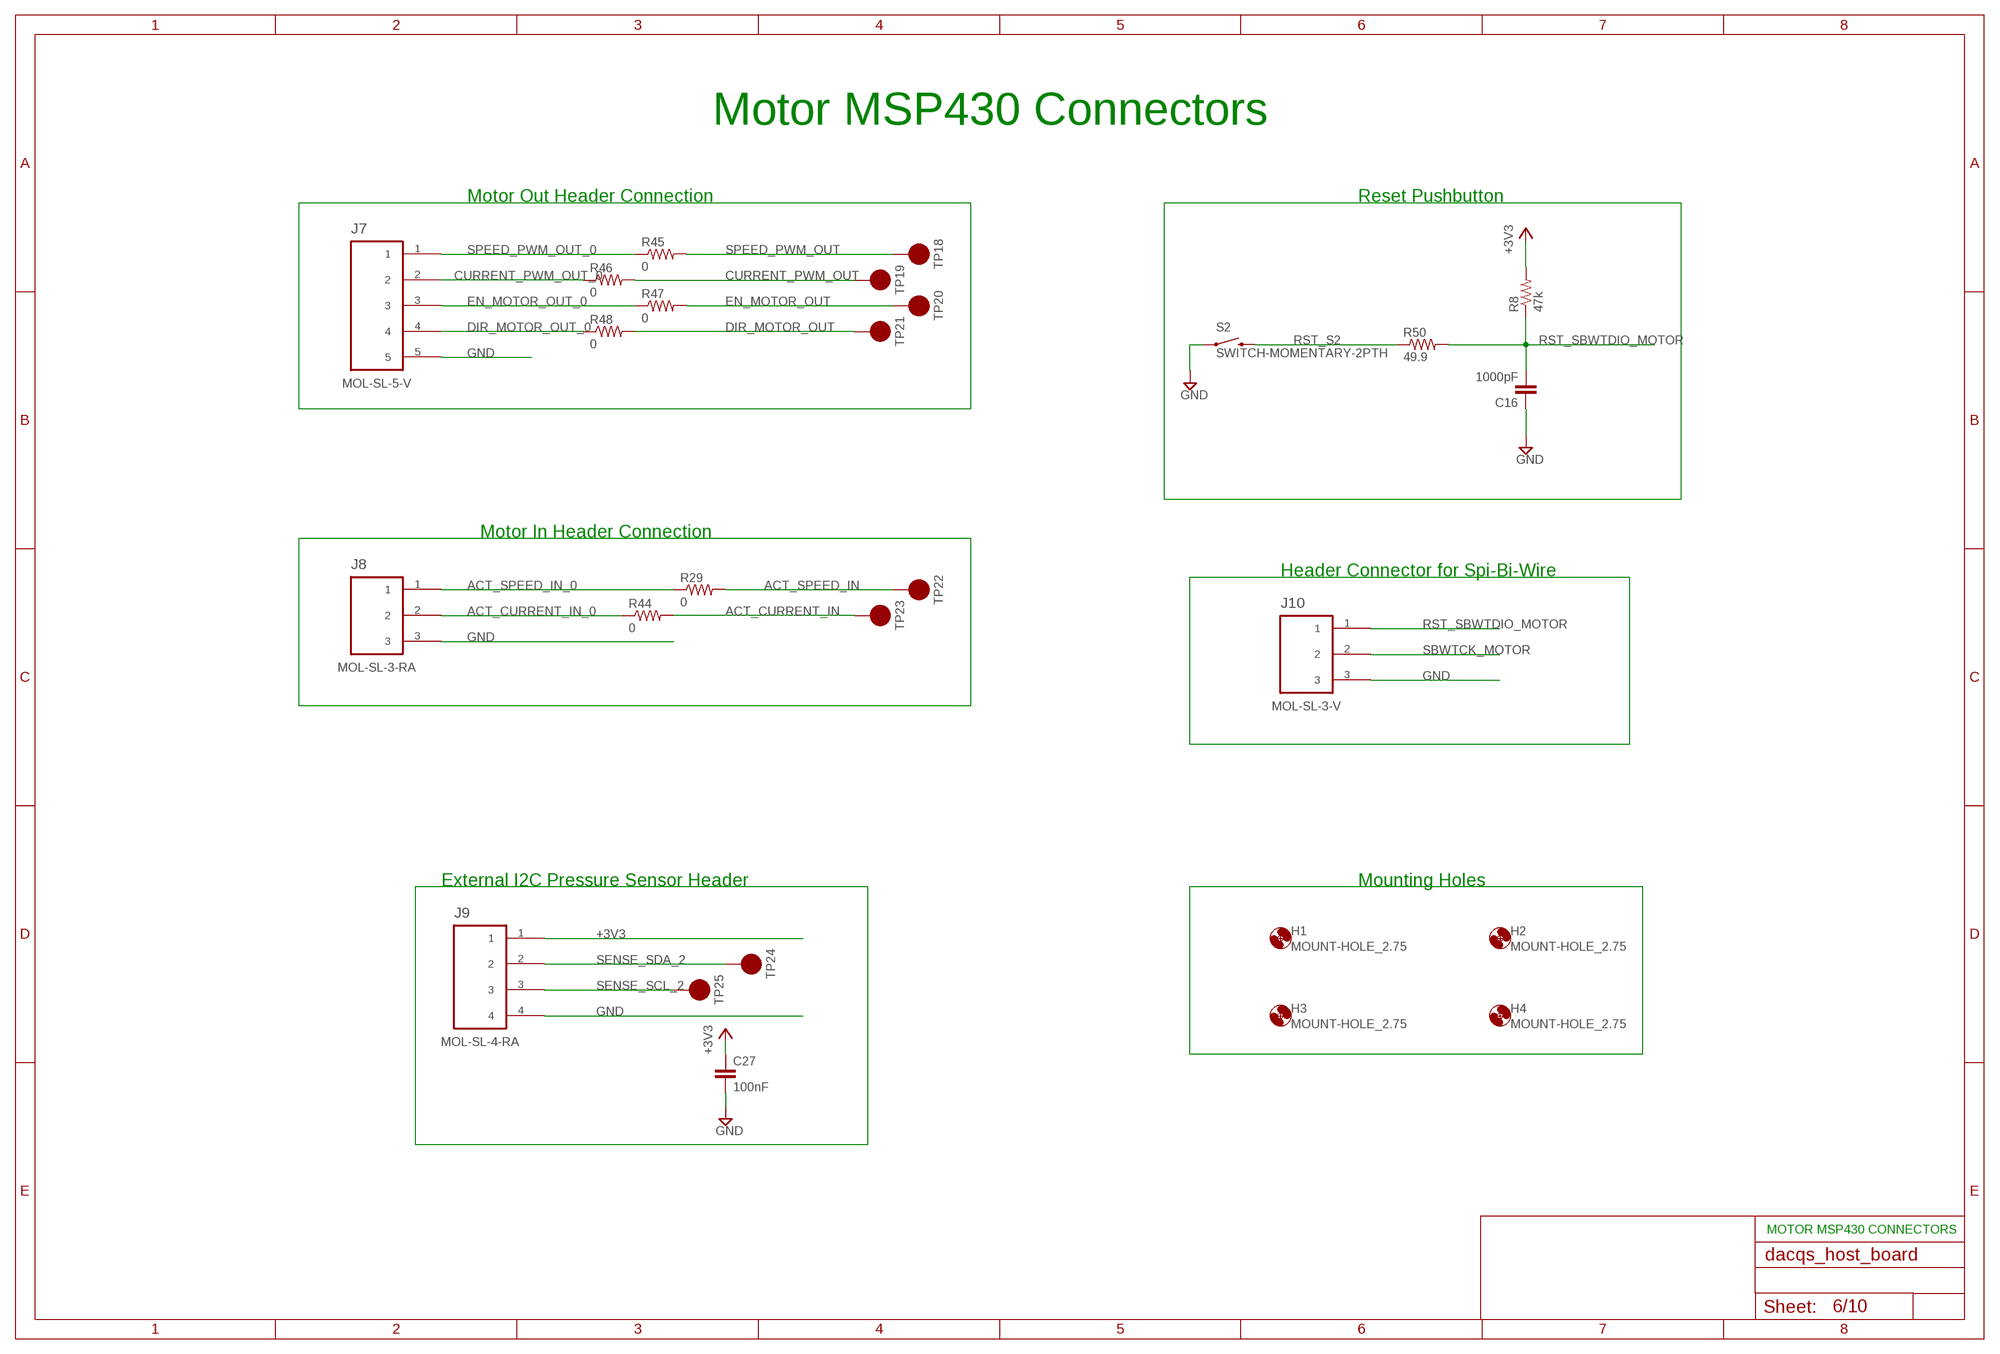
[diagram p5: schematic, sheet 6]

### Parts
C16  1000pF  CAP_1000PF0_0603  [C0603]
C27  100nF  CAP_100NF0_0603  [C0603]
H1  MOUNT-HOLE_2.75  [2,75_HOLE_RASPI]
H2  MOUNT-HOLE_2.75  [2,75_HOLE_RASPI]
H3  MOUNT-HOLE_2.75  [2,75_HOLE_RASPI]
H4  MOUNT-HOLE_2.75  [2,75_HOLE_RASPI]
J7  MOL-SL-5-V  MOLSL_5PIN_SL4V_V  [MOLSL-5-V]
J8  MOL-SL-3-RA  MOLSL_3PIN_SL3RA_RA  [MOLSL-3-RA]
J9  MOL-SL-4-RA  MOLSL_4PIN_SL4RA_RA  [MOLSL-4-RA]
J10  MOL-SL-3-V  MOLSL_3PIN_SL3V_V  [MOLSL-3-V]
R8  47k  RES_47R0_0603  [R0603]
R29  0  RES_0R0_0603  [R0603]
R44  0  RES_0R0_0603  [R0603]
R45  0  RES_0R0_0603  [R0603]
R46  0  RES_0R0_0603  [R0603]
R47  0  RES_0R0_0603  [R0603]
R48  0  RES_0R0_0603  [R0603]
R50  49.9  RES_0R499_0603  [R0603]
S2  SWITCH-MOMENTARY-2PTH  [TACTILE-PTH]
TP18  TEST_POINT_TP10R_SMD_10R_SMD  [TP10R]
TP19  TEST_POINT_TP10R_SMD_10R_SMD  [TP10R]
TP20  TEST_POINT_TP10R_SMD_10R_SMD  [TP10R]
TP21  TEST_POINT_TP10R_SMD_10R_SMD  [TP10R]
TP22  TEST_POINT_TP10R_SMD_10R_SMD  [TP10R]
TP23  TEST_POINT_TP10R_SMD_10R_SMD  [TP10R]
TP24  TEST_POINT_TP10R_SMD_10R_SMD  [TP10R]
TP25  TEST_POINT_TP10R_SMD_10R_SMD  [TP10R]

### Nets
+3V3: C27.1 J9.1 R8.2 ; also sheet 3,4,5,7,8,9
ACT_CURRENT_IN: R44.2 TP23.TP ; also sheet 4
ACT_CURRENT_IN_0: J8.2 R44.1
ACT_SPEED_IN: R29.2 TP22.TP ; also sheet 4
ACT_SPEED_IN_0: J8.1 R29.1
CURRENT_PWM_OUT: R46.2 TP19.TP ; also sheet 4
CURRENT_PWM_OUT_0: J7.2 R46.1
DIR_MOTOR_OUT: R48.2 TP21.TP ; also sheet 4
DIR_MOTOR_OUT_0: J7.4 R48.1
EN_MOTOR_OUT: R47.2 TP20.TP ; also sheet 4
EN_MOTOR_OUT_0: J7.3 R47.1
GND: C16.1 C27.2 J7.5 J8.3 J9.4 J10.3 S2.1 ; also sheet 3,4,5,7,8,9
RST_S2: R50.1 S2.3
RST_SBWTDIO_MOTOR: C16.2 J10.1 R8.1 R50.2 ; also sheet 4
SBWTCK_MOTOR: J10.2 ; also sheet 4
SENSE_SCL_2: J9.3 TP25.TP ; also sheet 4
SENSE_SDA_2: J9.2 TP24.TP ; also sheet 4
SPEED_PWM_OUT: R45.2 TP18.TP ; also sheet 4
SPEED_PWM_OUT_0: J7.1 R45.1

### Notes on the sheet
- Motor MSP430 Connectors
- Motor Out Header Connection | Reset Pushbutton
- Motor In Header Connection
- Header Connector for Spi-Bi-Wire
- External I2C Pressure Sensor Header | Mounting Holes
- MOTOR MSP430 CONNECTORS

## Sheet 7 of 10
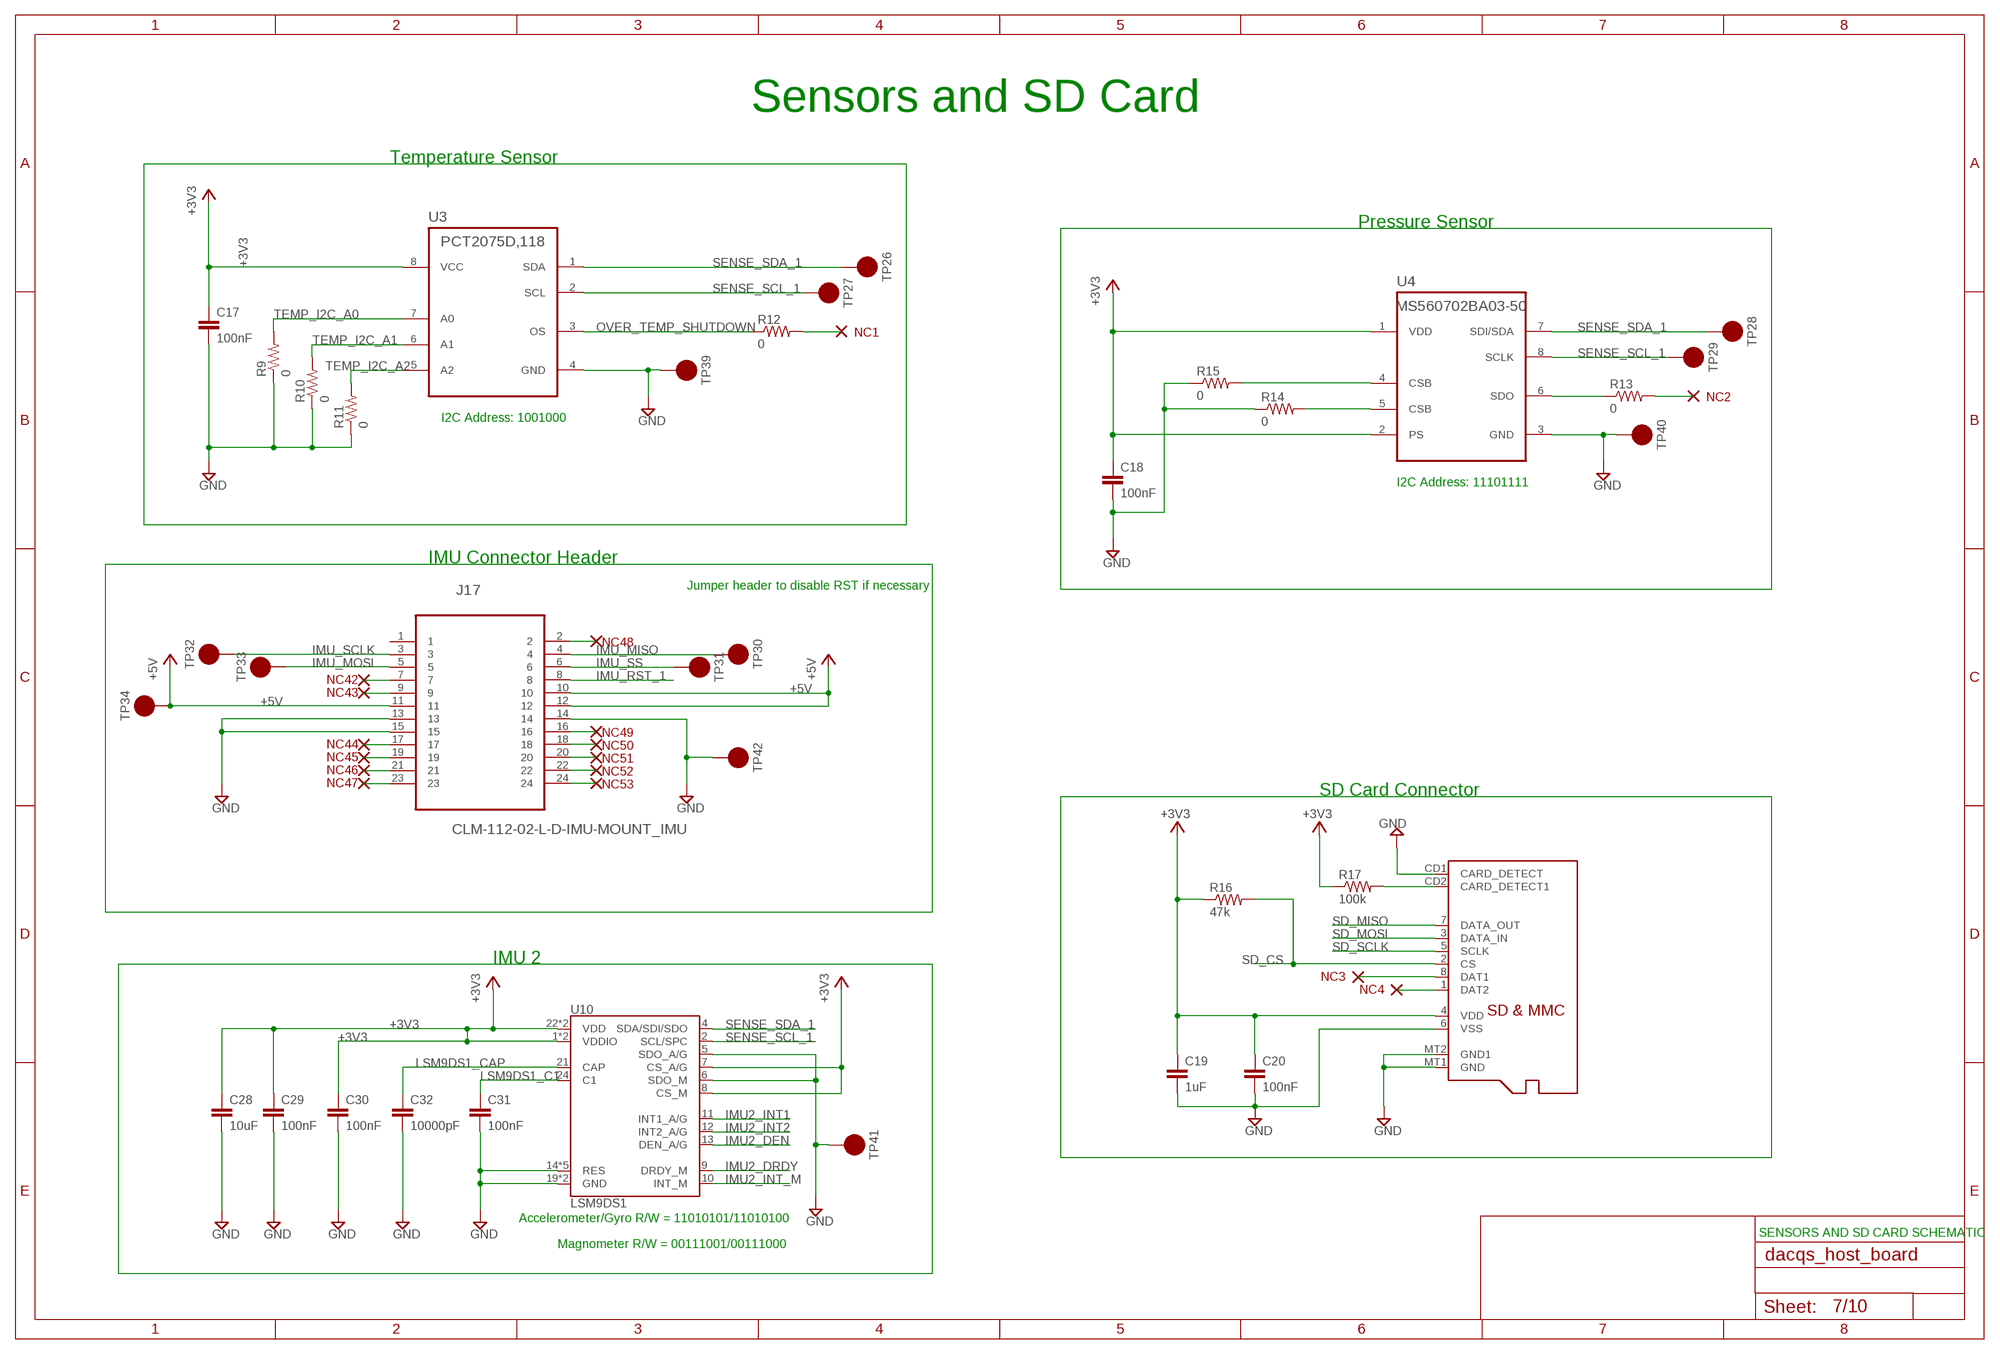
[diagram p6: schematic, sheet 7]

### Parts
C17  100nF  CAP_100NF0_0603  [C0603]
C18  100nF  CAP_100NF0_0603  [C0603]
C19  1uF  CAP_1UF0_0603  [C0603]
C20  100nF  CAP_100NF0_0603  [C0603]
C28  10uF  CAP_10UF0_0603  [C0603]
C29  100nF  CAP_100NF0_0603  [C0603]
C30  100nF  CAP_100NF0_0603  [C0603]
C31  100nF  CAP_100NF0_0603  [C0603]
C32  10000pF  CAP_10000PF0_0603  [C0603]
J17  CLM-112-02-L-D-IMU-MOUNT_IMU  [SAMTEC_CLM-112-02-L-D-IMU-MOUNT]
NC1  NC  NO_CONNECT  (no package)
NC2  NC  NO_CONNECT  (no package)
NC3  NC  NO_CONNECT  (no package)
NC4  NC  NO_CONNECT  (no package)
NC42  NC  NO_CONNECT  (no package)
NC43  NC  NO_CONNECT  (no package)
NC44  NC  NO_CONNECT  (no package)
NC45  NC  NO_CONNECT  (no package)
NC46  NC  NO_CONNECT  (no package)
NC47  NC  NO_CONNECT  (no package)
NC48  NC  NO_CONNECT  (no package)
NC49  NC  NO_CONNECT  (no package)
NC50  NC  NO_CONNECT  (no package)
NC51  NC  NO_CONNECT  (no package)
NC52  NC  NO_CONNECT  (no package)
NC53  NC  NO_CONNECT  (no package)
R9  0  RES_0R0_0603  [R0603]
R10  0  RES_0R0_0603  [R0603]
R11  0  RES_0R0_0603  [R0603]
R12  0  RES_0R0_0603  [R0603]
R13  0  RES_0R0_0603  [R0603]
R14  0  RES_0R0_0603  [R0603]
R15  0  RES_0R0_0603  [R0603]
R16  47k  RES_47R0_0603  [R0603]
R17  100k  RES_100R0_0603  [R0603]
TP26  TEST_POINT_TP10R_SMD_10R_SMD  [TP10R]
TP27  TEST_POINT_TP10R_SMD_10R_SMD  [TP10R]
TP28  TEST_POINT_TP10R_SMD_10R_SMD  [TP10R]
TP29  TEST_POINT_TP10R_SMD_10R_SMD  [TP10R]
TP30  TEST_POINT_TP10R_SMD_10R_SMD  [TP10R]
TP31  TEST_POINT_TP10R_SMD_10R_SMD  [TP10R]
TP32  TEST_POINT_TP10R_SMD_10R_SMD  [TP10R]
TP33  TEST_POINT_TP10R_SMD_10R_SMD  [TP10R]
TP34  TEST_POINT_TP10R_SMD_10R_SMD  [TP10R]
TP39  TEST_POINT_TP10R_SMD_10R_SMD  [TP10R]
TP40  TEST_POINT_TP10R_SMD_10R_SMD  [TP10R]
TP41  TEST_POINT_TP10R_SMD_10R_SMD  [TP10R]
TP42  TEST_POINT_TP10R_SMD_10R_SMD  [TP10R]
U3  PCT2075D,118  PCT2075D,118SOIC8  [SOIC127P130X0600-8N]
U4  MS560702BA03-50  MS5607-02BA03_8SMD  [SMD125P110X060-8N]
U10  LSM9DS1  [LGA24-8X4]
U$1  MICROSD  [MICROSD]

### Nets
+3V3: C17.1 C18.1 C19.1 C20.1 C28.1 C29.1 C30.1 R16.1 R17.1 U3.8(VCC) U4.1(VDD) U4.2(PS) U10.1(VDDIO) U10.3(VDDIO) U10.7(CS_A/G) U10.8(CS_M) U10.22(VDD) U10.23(VDD) U$1.4(VDD) ; also sheet 3,4,5,6,8,9
+5V: J17.10 J17.11 J17.12 TP34.TP ; also sheet 8
GND: C17.2 C18.2 C19.2 C20.2 C28.2 C29.2 C30.2 C31.2 C32.2 J17.13 J17.14 J17.15 R9.1 R10.1 R11.1 R14.1 R15.1 TP39.TP TP40.TP TP41.TP TP42.TP U3.4(GND) U4.3(GND) U10.5(SDO_A/G) U10.6(SDO_M) U10.14(RES) U10.15(RES) U10.16(RES) U10.17(RES) U10.18(RES) U10.19(GND) U10.20(GND) U$1.6(VSS) U$1.CD1(CARD_DETECT) U$1.MT1(GND) U$1.MT2(GND1) ; also sheet 3,4,5,6,8,9
IMU2_DEN: U10.13(DEN_A/G) ; also sheet 9
IMU2_DRDY: U10.9(DRDY_M) ; also sheet 9
IMU2_INT1: U10.11(INT1_A/G) ; also sheet 9
IMU2_INT2: U10.12(INT2_A/G) ; also sheet 9
IMU2_INT_M: U10.10(INT_M) ; also sheet 9
IMU_MISO: J17.4 TP30.TP ; also sheet 4
IMU_MOSI: J17.5 TP33.TP ; also sheet 4
IMU_RST_1: J17.8 ; also sheet 4
IMU_SCLK: J17.3 TP32.TP ; also sheet 4
IMU_SS: J17.6 TP31.TP ; also sheet 4
LSM9DS1_C1: C31.1 U10.24(C1)
LSM9DS1_CAP: C32.1 U10.21(CAP)
N$1: NC1.NC R12.2
N$2: NC3.NC U$1.8(DAT1)
N$3: NC4.NC U$1.1(DAT2)
N$27: R15.2 U4.4(CSB)
N$28: R14.2 U4.5(CSB)
N$29: R13.1 U4.6(SDO)
N$30: NC2.NC R13.2
N$47: J17.7 NC42.NC
N$48: J17.9 NC43.NC
N$49: J17.17 NC44.NC
N$50: J17.19 NC45.NC
N$51: J17.21 NC46.NC
N$52: J17.23 NC47.NC
N$53: J17.2 NC48.NC
N$54: J17.16 NC49.NC
N$55: J17.18 NC50.NC
N$56: J17.20 NC51.NC
N$57: J17.22 NC52.NC
N$58: J17.24 NC53.NC
OVER_TEMP_SHUTDOWN: R12.1 U3.3(OS)
SD_CS: R16.2 U$1.2(CS) ; also sheet 4
SD_DETECT: R17.2 U$1.CD2(CARD_DETECT1) ; also sheet 4
SD_MISO: U$1.7(DATA_OUT) ; also sheet 4
SD_MOSI: U$1.3(DATA_IN) ; also sheet 4
SD_SCLK: U$1.5(SCLK) ; also sheet 4
SENSE_SCL_1: TP27.TP TP29.TP U3.2(SCL) U4.8(SCLK) U10.2(SCL/SPC) ; also sheet 4,8
SENSE_SDA_1: TP26.TP TP28.TP U3.1(SDA) U4.7(SDI/SDA) U10.4(SDA/SDI/SDO) ; also sheet 4,8
TEMP_I2C_A0: R9.2 U3.7(A0)
TEMP_I2C_A1: R10.2 U3.6(A1)
TEMP_I2C_A2: R11.2 U3.5(A2)
Unconnected: J17.1

### Notes on the sheet
- Sensors and SD Card
- Temperature Sensor
- Pressure Sensor
- I2C Address: 1001000
- I2C Address: 11101111
- IMU Connector Header
- Jumper header to disable RST if necessary
- SD Card Connector
- IMU 2
- Accelerometer/Gyro R/W = 11010101/11010100
- SENSORS AND SD CARD SCHEMATIC
- Magnometer R/W = 00111001/00111000

## Sheet 8 of 10
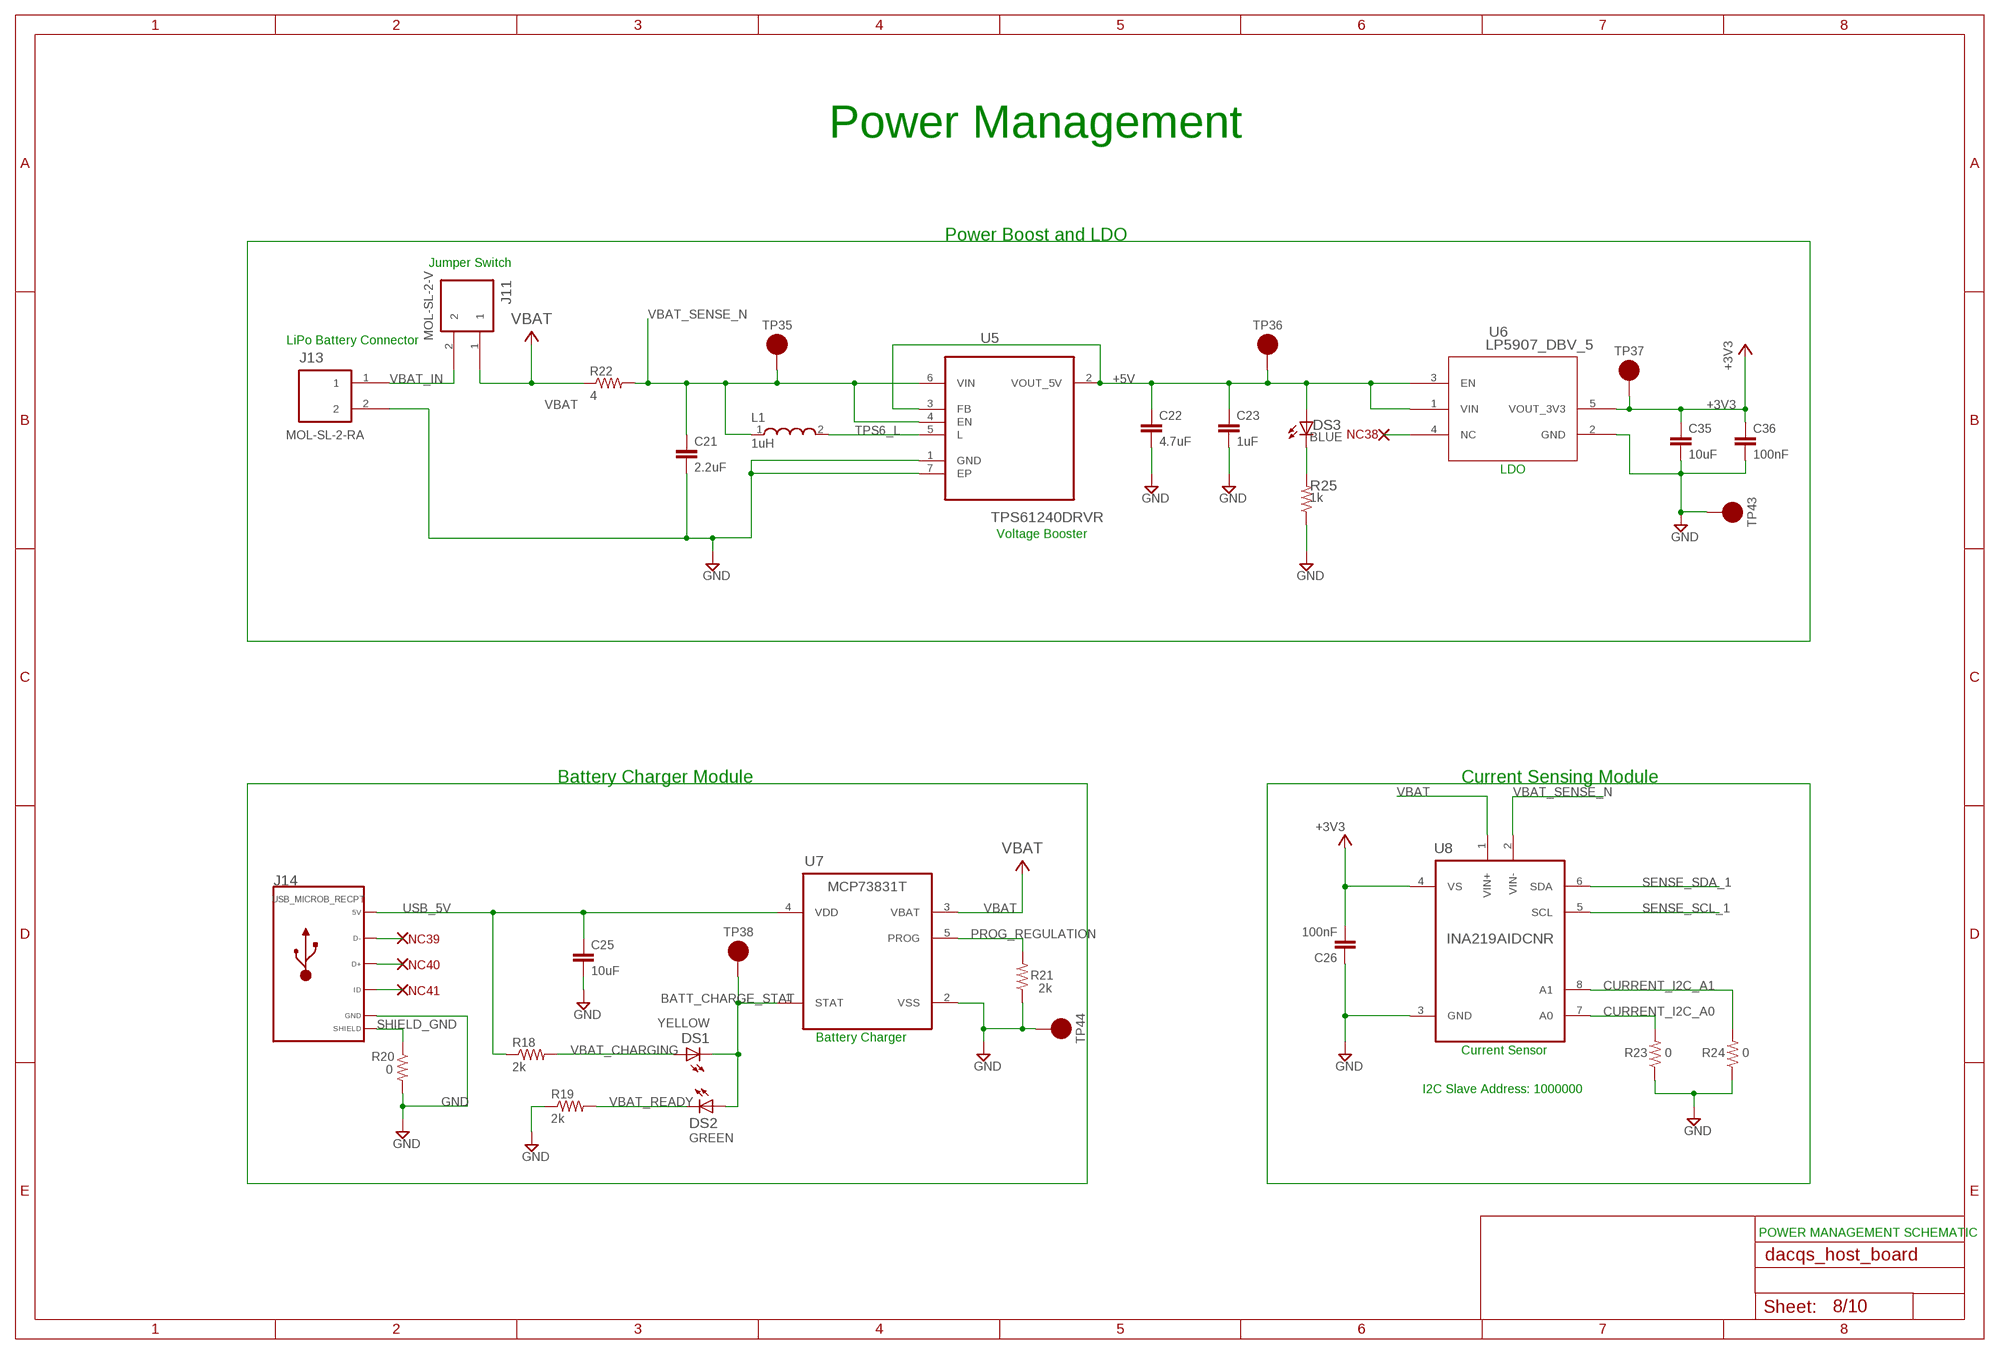
[diagram p7: schematic, sheet 8]

### Parts
C21  2.2uF  CAP_2UF2_0603  [C0603]
C22  4.7uF  CAP_4UF7_0603  [C0603]
C23  1uF  CAP_1UF0_0603  [C0603]
C25  10uF  CAP_10UF0_0603  [C0603]
C26  100nF  CAP_100NF0_0603  [C0603]
C35  10uF  CAP_10UF0_0603  [C0603]
C36  100nF  CAP_100NF0_0603  [C0603]
DS1  YELLOW  LED_Y2V0WURTH_0603  [LED0603]
DS2  GREEN  LED_G3V2WURTH_0603  [LED0603]
DS3  BLUE  LED_B3V2WURTH_0603  [LED0603]
J11  MOL-SL-2-V  MOLSL_2PIN_SL2V_V  [MOLSL-2-V]
J13  MOL-SL-2-RA  MOLSL_2PIN_SL2RA_RA  [MOLSL-2-RA]
J14  USB_MICROB_RECPT  USB_B_MICRO_RIGHT  [MICROUSB-RIGHT]
L1  1uH  IND_1UH0_0805  [WE-PMI_0805]
NC38  NC  NO_CONNECT  (no package)
NC39  NC  NO_CONNECT  (no package)
NC40  NC  NO_CONNECT  (no package)
NC41  NC  NO_CONNECT  (no package)
R18  2k  RES_2R0_0603  [R0603]
R19  2k  RES_2R0_0603  [R0603]
R20  0  RES_0R0_0603  [R0603]
R21  2k  RES_2R0_0603  [R0603]
R22  4  RES_4R0_0603  [R0603]
R23  0  RES_0R0_0603  [R0603]
R24  0  RES_0R0_0603  [R0603]
R25  1k  RES_1R0_0603  [R0603]
TP35  TEST_POINT_TP10R_SMD_10R_SMD  [TP10R]
TP36  TEST_POINT_TP10R_SMD_10R_SMD  [TP10R]
TP37  TEST_POINT_TP10R_SMD_10R_SMD  [TP10R]
TP38  TEST_POINT_TP10R_SMD_10R_SMD  [TP10R]
TP43  TEST_POINT_TP10R_SMD_10R_SMD  [TP10R]
TP44  TEST_POINT_TP10R_SMD_10R_SMD  [TP10R]
U5  TPS61240DRVR  [SON65P200X200X80-7N]
U6  LP5907_DBV_5  [DBV5]
U7  MCP73831T  MCP73831T-2ATI/OT  [SOT23P110X060-5N]
U8  INA219AIDCNR  [SOT65P110X045-8N]

### Nets
+3V3: C26.2 C35.1 C36.1 TP37.TP U6.5(VOUT_3V3) U8.4(VS) ; also sheet 3,4,5,6,7,9
+5V: C22.1 C23.1 DS3.2(A) TP36.TP U5.2(VOUT_5V) U5.3(FB) U6.1(VIN) U6.3(EN) ; also sheet 7
BATT_CHARGE_STAT: DS1.1(C) DS2.2(A) TP38.TP U7.1(STAT)
CURRENT_I2C_A0: R23.2 U8.7(A0)
CURRENT_I2C_A1: R24.2 U8.8(A1)
GND: C21.2 C22.2 C23.2 C25.2 C26.1 C35.2 C36.2 J13.2 J14.5(GND) R19.1 R20.2 R21.1 R23.1 R24.1 R25.1 TP43.TP TP44.TP U5.1(GND) U5.7(EP) U6.2(GND) U7.2(VSS) U8.3(GND) ; also sheet 3,4,5,6,7,9
LED_BLUE_5V: DS3.1(C) R25.2
N$43: NC38.NC U6.4(NC)
N$44: J14.2(D-) NC39.NC
N$45: J14.3(D+) NC40.NC
N$46: J14.4(ID) NC41.NC
PROG_REGULATION: R21.2 U7.5(PROG)
SENSE_SCL_1: U8.5(SCL) ; also sheet 4,7
SENSE_SDA_1: U8.6(SDA) ; also sheet 4,7
SHIELD_GND: J14.S1(SLD) J14.S2(SLD) J14.S3(SLD) J14.S4(SLD) J14.S5(SLD) J14.S6(SLD) R20.1
TPS6_L: L1.2 U5.5(L)
USB_5V: C25.1 J14.1(5V) R18.1 U7.4(VDD)
VBAT: J11.1 R22.1 U7.3(VBAT) U8.1(VIN+)
VBAT_CHARGING: DS1.2(A) R18.2
VBAT_IN: J11.2 J13.1
VBAT_READY: DS2.1(C) R19.2
VBAT_SENSE_N: C21.1 L1.1 R22.2 TP35.TP U5.4(EN) U5.6(VIN) U8.2(VIN-)

### Notes on the sheet
- Power Management
- Power Boost and LDO
- Jumper Switch
- LiPo Battery Connector
- LDO
- Voltage Booster
- Battery Charger Module | Current Sensing Module
- Battery Charger
- Current Sensor
- I2C Slave Address: 1000000
- POWER MANAGEMENT SCHEMATIC

## Sheet 9 of 10
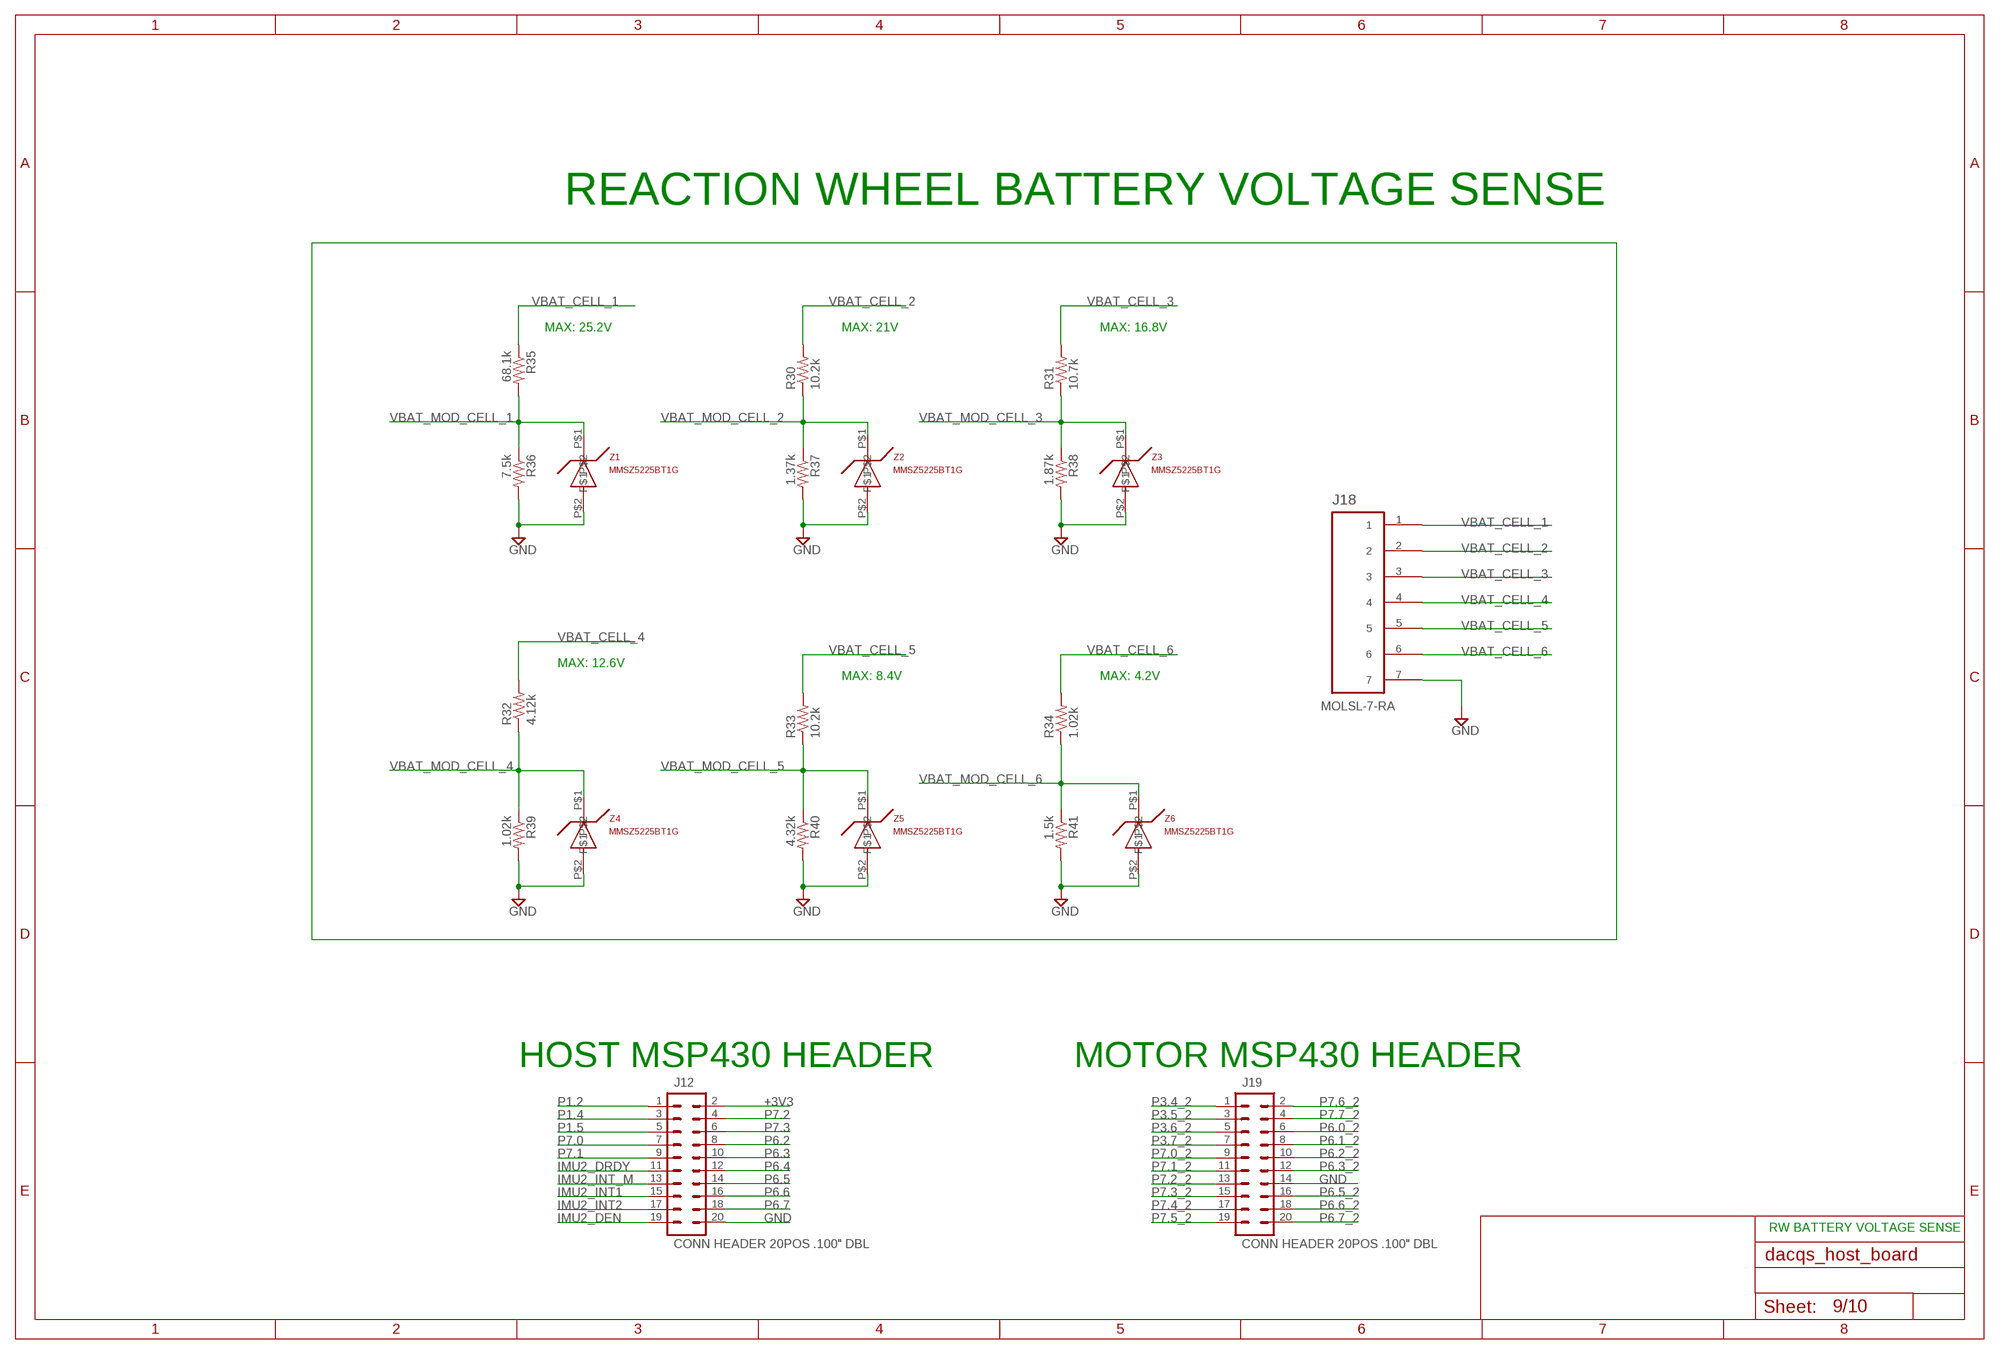
[diagram p8: schematic, sheet 9]

### Parts
J12  CONN HEADER 20POS .100" DBL  M10X2  [2X10]
J18  MOLSL-7-RA  MOLSL_7PIN_RA  [MOLSL-7-RA]
J19  CONN HEADER 20POS .100" DBL  M10X2  [2X10]
R30  10.2k  RES_10R2_0603  [R0603]
R31  10.7k  RES_10R7_0603  [R0603]
R32  4.12k  RES_4R12_0603  [R0603]
R33  10.2k  RES_10R2_0603  [R0603]
R34  1.02k  RES_1R02_0603  [R0603]
R35  68.1k  RES_68R1_0603  [R0603]
R36  7.5k  RES_7R5_0603  [R0603]
R37  1.37k  RES_1R37_0603  [R0603]
R38  1.87k  RES_1R87_0603  [R0603]
R39  1.02k  RES_1R02_0603  [R0603]
R40  4.32k  RES_4R32_0603  [R0603]
R41  1.5k  RES_1R5_0603  [R0603]
Z1  MMSZ5225BT1G  [MMSZ5225BT1G]
Z2  MMSZ5225BT1G  [MMSZ5225BT1G]
Z3  MMSZ5225BT1G  [MMSZ5225BT1G]
Z4  MMSZ5225BT1G  [MMSZ5225BT1G]
Z5  MMSZ5225BT1G  [MMSZ5225BT1G]
Z6  MMSZ5225BT1G  [MMSZ5225BT1G]

### Nets
+3V3: J12.2 ; also sheet 3,4,5,6,7,8
GND: J12.20 J18.7 J19.14 R36.2 R37.2 R38.2 R39.2 R40.2 R41.2 Z1.P$2 Z2.P$2 Z3.P$2 Z4.P$2 Z5.P$2 Z6.P$2 ; also sheet 3,4,5,6,7,8
IMU2_DEN: J12.19 ; also sheet 7
IMU2_DRDY: J12.11 ; also sheet 7
IMU2_INT1: J12.15 ; also sheet 7
IMU2_INT2: J12.17 ; also sheet 7
IMU2_INT_M: J12.13 ; also sheet 7
P1.2: J12.1 ; also sheet 3
P1.4: J12.3 ; also sheet 3
P1.5: J12.5 ; also sheet 3
P3.4_2: J19.1 ; also sheet 4
P3.5_2: J19.3 ; also sheet 4
P3.6_2: J19.5 ; also sheet 4
P3.7_2: J19.7 ; also sheet 4
P6.0_2: J19.6 ; also sheet 4
P6.1_2: J19.8 ; also sheet 4
P6.2: J12.8 ; also sheet 3
P6.2_2: J19.10 ; also sheet 4
P6.3: J12.10 ; also sheet 3
P6.3_2: J19.12 ; also sheet 4
P6.4: J12.12 ; also sheet 3
P6.5: J12.14 ; also sheet 3
P6.5_2: J19.16 ; also sheet 4
P6.6: J12.16 ; also sheet 3
P6.6_2: J19.18 ; also sheet 4
P6.7: J12.18 ; also sheet 3
P6.7_2: J19.20 ; also sheet 4
P7.0: J12.7 ; also sheet 3
P7.0_2: J19.9 ; also sheet 4
P7.1: J12.9 ; also sheet 3
P7.1_2: J19.11 ; also sheet 4
P7.2: J12.4 ; also sheet 3
P7.2_2: J19.13 ; also sheet 4
P7.3: J12.6 ; also sheet 3
P7.3_2: J19.15 ; also sheet 4
P7.4_2: J19.17 ; also sheet 4
P7.5_2: J19.19 ; also sheet 4
P7.6_2: J19.2 ; also sheet 4
P7.7_2: J19.4 ; also sheet 4
VBAT_CELL_1: J18.1 R35.1
VBAT_CELL_2: J18.2 R30.2
VBAT_CELL_3: J18.3 R31.2
VBAT_CELL_4: J18.4 R32.2
VBAT_CELL_5: J18.5 R33.2
VBAT_CELL_6: J18.6 R34.2
VBAT_MOD_CELL_1: R35.2 R36.1 Z1.P$1 ; also sheet 3
VBAT_MOD_CELL_2: R30.1 R37.1 Z2.P$1 ; also sheet 3
VBAT_MOD_CELL_3: R31.1 R38.1 Z3.P$1 ; also sheet 3
VBAT_MOD_CELL_4: R32.1 R39.1 Z4.P$1 ; also sheet 3
VBAT_MOD_CELL_5: R33.1 R40.1 Z5.P$1 ; also sheet 3
VBAT_MOD_CELL_6: R34.1 R41.1 Z6.P$1 ; also sheet 3

### Notes on the sheet
- REACTION WHEEL BATTERY VOLTAGE SENSE
- MAX: 25.2V | MAX: 21V | MAX: 16.8V
- MAX: 12.6V
- MAX: 8.4V | MAX: 4.2V
- HOST MSP430 HEADER | MOTOR MSP430 HEADER
- RW BATTERY VOLTAGE SENSE

## Sheet 10 of 10
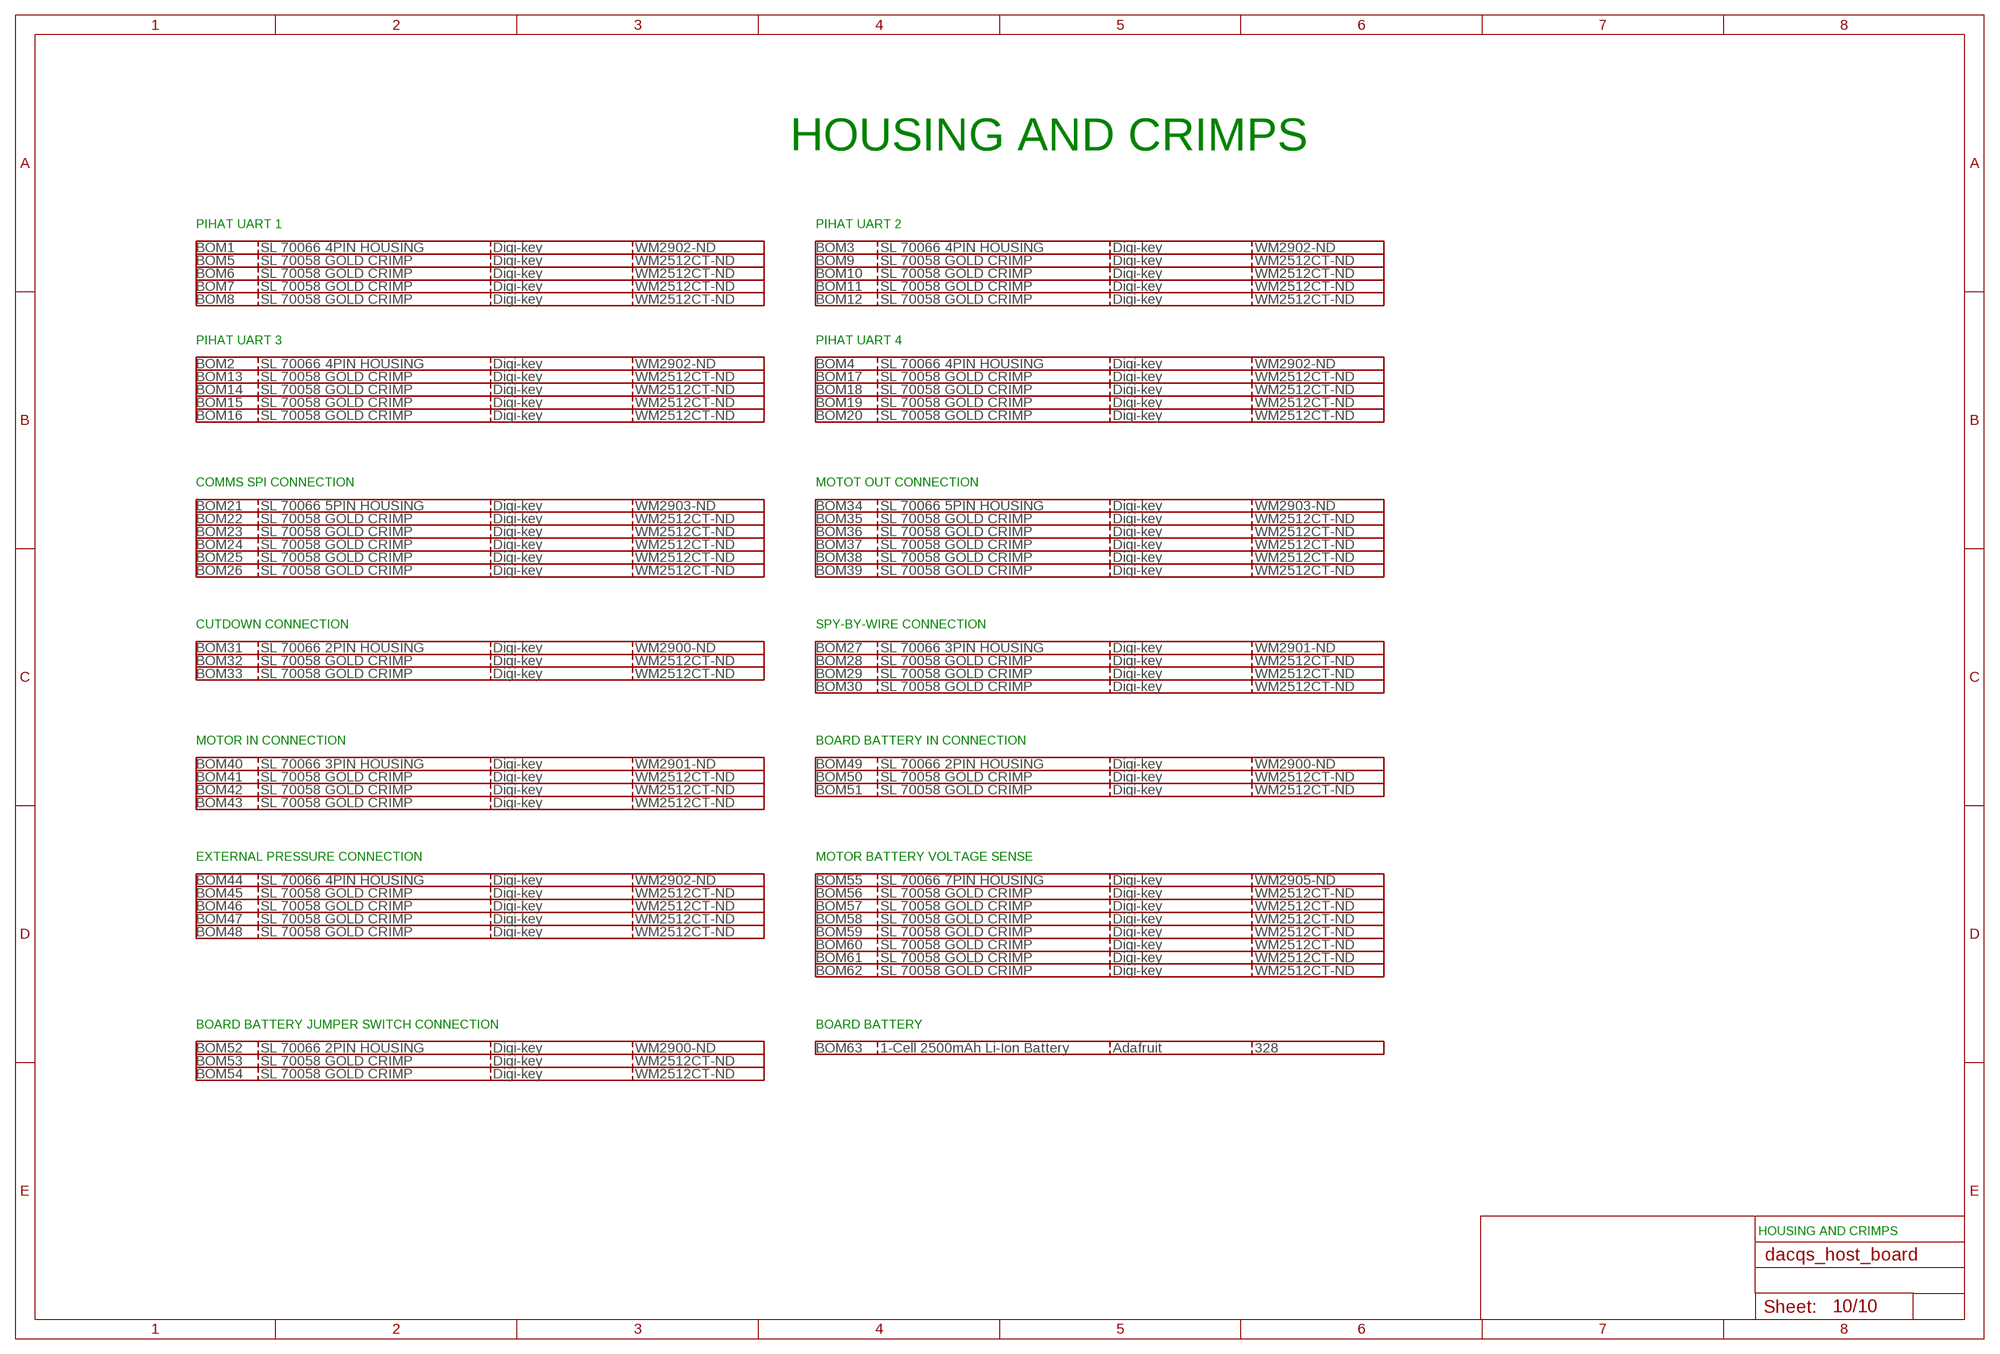
[diagram p9: schematic, sheet 10]

### Parts
BOM1  SL 70066 4PIN HOUSING  BOM_LINE_ITEM_BLI4  [BLANK]
BOM2  SL 70066 4PIN HOUSING  BOM_LINE_ITEM_BLI4  [BLANK]
BOM3  SL 70066 4PIN HOUSING  BOM_LINE_ITEM_BLI4  [BLANK]
BOM4  SL 70066 4PIN HOUSING  BOM_LINE_ITEM_BLI4  [BLANK]
BOM5  SL 70058 GOLD CRIMP  BOM_LINE_ITEM_BLI6  [BLANK]
BOM6  SL 70058 GOLD CRIMP  BOM_LINE_ITEM_BLI6  [BLANK]
BOM7  SL 70058 GOLD CRIMP  BOM_LINE_ITEM_BLI6  [BLANK]
BOM8  SL 70058 GOLD CRIMP  BOM_LINE_ITEM_BLI6  [BLANK]
BOM9  SL 70058 GOLD CRIMP  BOM_LINE_ITEM_BLI6  [BLANK]
BOM10  SL 70058 GOLD CRIMP  BOM_LINE_ITEM_BLI6  [BLANK]
BOM11  SL 70058 GOLD CRIMP  BOM_LINE_ITEM_BLI6  [BLANK]
BOM12  SL 70058 GOLD CRIMP  BOM_LINE_ITEM_BLI6  [BLANK]
BOM13  SL 70058 GOLD CRIMP  BOM_LINE_ITEM_BLI6  [BLANK]
BOM14  SL 70058 GOLD CRIMP  BOM_LINE_ITEM_BLI6  [BLANK]
BOM15  SL 70058 GOLD CRIMP  BOM_LINE_ITEM_BLI6  [BLANK]
BOM16  SL 70058 GOLD CRIMP  BOM_LINE_ITEM_BLI6  [BLANK]
BOM17  SL 70058 GOLD CRIMP  BOM_LINE_ITEM_BLI6  [BLANK]
BOM18  SL 70058 GOLD CRIMP  BOM_LINE_ITEM_BLI6  [BLANK]
BOM19  SL 70058 GOLD CRIMP  BOM_LINE_ITEM_BLI6  [BLANK]
BOM20  SL 70058 GOLD CRIMP  BOM_LINE_ITEM_BLI6  [BLANK]
BOM21  SL 70066 5PIN HOUSING  BOM_LINE_ITEM_BLI5  [BLANK]
BOM22  SL 70058 GOLD CRIMP  BOM_LINE_ITEM_BLI6  [BLANK]
BOM23  SL 70058 GOLD CRIMP  BOM_LINE_ITEM_BLI6  [BLANK]
BOM24  SL 70058 GOLD CRIMP  BOM_LINE_ITEM_BLI6  [BLANK]
BOM25  SL 70058 GOLD CRIMP  BOM_LINE_ITEM_BLI6  [BLANK]
BOM26  SL 70058 GOLD CRIMP  BOM_LINE_ITEM_BLI6  [BLANK]
BOM27  SL 70066 3PIN HOUSING  BOM_LINE_ITEM_BLI3  [BLANK]
BOM28  SL 70058 GOLD CRIMP  BOM_LINE_ITEM_BLI6  [BLANK]
BOM29  SL 70058 GOLD CRIMP  BOM_LINE_ITEM_BLI6  [BLANK]
BOM30  SL 70058 GOLD CRIMP  BOM_LINE_ITEM_BLI6  [BLANK]
BOM31  SL 70066 2PIN HOUSING  BOM_LINE_ITEM_BLI2  [BLANK]
BOM32  SL 70058 GOLD CRIMP  BOM_LINE_ITEM_BLI6  [BLANK]
BOM33  SL 70058 GOLD CRIMP  BOM_LINE_ITEM_BLI6  [BLANK]
BOM34  SL 70066 5PIN HOUSING  BOM_LINE_ITEM_BLI5  [BLANK]
BOM35  SL 70058 GOLD CRIMP  BOM_LINE_ITEM_BLI6  [BLANK]
BOM36  SL 70058 GOLD CRIMP  BOM_LINE_ITEM_BLI6  [BLANK]
BOM37  SL 70058 GOLD CRIMP  BOM_LINE_ITEM_BLI6  [BLANK]
BOM38  SL 70058 GOLD CRIMP  BOM_LINE_ITEM_BLI6  [BLANK]
BOM39  SL 70058 GOLD CRIMP  BOM_LINE_ITEM_BLI6  [BLANK]
BOM40  SL 70066 3PIN HOUSING  BOM_LINE_ITEM_BLI3  [BLANK]
BOM41  SL 70058 GOLD CRIMP  BOM_LINE_ITEM_BLI6  [BLANK]
BOM42  SL 70058 GOLD CRIMP  BOM_LINE_ITEM_BLI6  [BLANK]
BOM43  SL 70058 GOLD CRIMP  BOM_LINE_ITEM_BLI6  [BLANK]
BOM44  SL 70066 4PIN HOUSING  BOM_LINE_ITEM_BLI4  [BLANK]
BOM45  SL 70058 GOLD CRIMP  BOM_LINE_ITEM_BLI6  [BLANK]
BOM46  SL 70058 GOLD CRIMP  BOM_LINE_ITEM_BLI6  [BLANK]
BOM47  SL 70058 GOLD CRIMP  BOM_LINE_ITEM_BLI6  [BLANK]
BOM48  SL 70058 GOLD CRIMP  BOM_LINE_ITEM_BLI6  [BLANK]
BOM49  SL 70066 2PIN HOUSING  BOM_LINE_ITEM_BLI2  [BLANK]
BOM50  SL 70058 GOLD CRIMP  BOM_LINE_ITEM_BLI6  [BLANK]
BOM51  SL 70058 GOLD CRIMP  BOM_LINE_ITEM_BLI6  [BLANK]
BOM52  SL 70066 2PIN HOUSING  BOM_LINE_ITEM_BLI2  [BLANK]
BOM53  SL 70058 GOLD CRIMP  BOM_LINE_ITEM_BLI6  [BLANK]
BOM54  SL 70058 GOLD CRIMP  BOM_LINE_ITEM_BLI6  [BLANK]
BOM55  SL 70066 7PIN HOUSING  BOM_LINE_ITEM_BL12  [BLANK]
BOM56  SL 70058 GOLD CRIMP  BOM_LINE_ITEM_BLI6  [BLANK]
BOM57  SL 70058 GOLD CRIMP  BOM_LINE_ITEM_BLI6  [BLANK]
BOM58  SL 70058 GOLD CRIMP  BOM_LINE_ITEM_BLI6  [BLANK]
BOM59  SL 70058 GOLD CRIMP  BOM_LINE_ITEM_BLI6  [BLANK]
BOM60  SL 70058 GOLD CRIMP  BOM_LINE_ITEM_BLI6  [BLANK]
BOM61  SL 70058 GOLD CRIMP  BOM_LINE_ITEM_BLI6  [BLANK]
BOM62  SL 70058 GOLD CRIMP  BOM_LINE_ITEM_BLI6  [BLANK]
BOM63  1-Cell 2500mAh Li-Ion Battery  BOM_LINE_ITEM_BLI11  [BLANK]

### Notes on the sheet
- HOUSING AND CRIMPS
- PIHAT UART 1 | PIHAT UART 2
- PIHAT UART 3 | PIHAT UART 4
- COMMS SPI CONNECTION | MOTOT OUT CONNECTION
- CUTDOWN CONNECTION | SPY-BY-WIRE CONNECTION
- MOTOR IN CONNECTION | BOARD BATTERY IN CONNECTION
- EXTERNAL PRESSURE CONNECTION | MOTOR BATTERY VOLTAGE SENSE
- BOARD BATTERY JUMPER SWITCH CONNECTION | BOARD BATTERY
- HOUSING AND CRIMPS

## Library data of the parts
BAT1 = daqcs_host:BC9VPC: 9V board-mount battery cradle; MANUFACTURER: MPD; MANUFACTURER_PN: BH9VPC; PROD_ID: BATT-10855; VENDOR: Digi-key; VENDOR_PN: BH9V-PC-ND
BOM1-BOM4 BOM44 = daqcs_host:BOM_LINE_ITEM; DATASHEET: HW/docs/projects/raspi_zero_power_sensor_hat/datasheets/connectors/uart_1wire_power_battery/050579402_sd.pdf; MANUFACTURER: Molex; MANUFACTURER_PN: 0050579404; VENDOR: Digi-key; VENDOR_PN: WM2902-ND
BOM5-BOM20 BOM22-BOM26 BOM28-BOM30 BOM32 BOM33 BOM35-BOM39 BOM41-BOM43 BOM45-BOM48 BOM50 BOM51 BOM53 BOM54 BOM56-BOM62 = daqcs_host:BOM_LINE_ITEM; DATASHEET: HW/docs/projects/raspi_zero_power_sensor_hat/datasheets/connectors/uart_1wire_power_battery/016020087_sd.pdf; MANUFACTURER: Molex; MANUFACTURER_PN: 0016020087; VENDOR: Digi-key; VENDOR_PN: WM2512CT-ND
BOM21 BOM34 = daqcs_host:BOM_LINE_ITEM; DATASHEET: HW/docs/projects/raspi_zero_power_sensor_hat/datasheets/connectors/uart_1wire_power_battery/050579402_sd.pdf; MANUFACTURER: Molex; MANUFACTURER_PN: 0050579405; VENDOR: Digi-key; VENDOR_PN: WM2903-ND
BOM27 BOM40 = daqcs_host:BOM_LINE_ITEM; DATASHEET: HW/docs/projects/raspi_zero_power_sensor_hat/datasheets/connectors/uart_1wire_power_battery/050579402_sd.pdf; MANUFACTURER: Molex; MANUFACTURER_PN: 50-57-9403; VENDOR: Digi-key; VENDOR_PN: WM2901-ND
BOM31 BOM49 BOM52 = daqcs_host:BOM_LINE_ITEM; DATASHEET: HW/docs/projects/raspi_zero_power_sensor_hat/datasheets/connectors/uart_1wire_power_battery/050579402_sd.pdf; MANUFACTURER: Molex; MANUFACTURER_PN: 50-57-9402; VENDOR: Digi-key; VENDOR_PN: WM2900-ND
BOM55 = daqcs_host:BOM_LINE_ITEM; MANUFACTURER: Molex; MANUFACTURER_PN: 0050579407; VENDOR: Digi-key; VENDOR_PN: WM2905-ND
BOM63 = daqcs_host:BOM_LINE_ITEM; DATASHEET: HW/docs/projects/raspi_zero_power_sensor_hat/datasheets/battery/785060-2500mAh_specification_sheet.pdf; MANUFACTURER: Adafruit; MANUFACTURER_PN: 328; VENDOR: Adafruit; VENDOR_PN: 328
C1-C4 C6-C9 C17 C18 C20 C26 C27 C29-C31 C36 = daqcs_host:CAP: Chip Capacitor; MANUFACTURER: Murata; MANUFACTURER_PN: GRM188R71C104KA01D; TEMP_COEFF: X7R; TOLERANCE: 10%; VENDOR: Digi-key; VENDOR_PN: 490-1532-1-ND; VOLTAGE: 16V
C5 C10 C25 C28 C35 = daqcs_host:CAP: Chip Capacitor; MANUFACTURER: Murata; MANUFACTURER_PN: GRM188R61A106KE69D; TEMP_COEFF: X5R; TOLERANCE: 10%; VENDOR: Digi-key; VENDOR_PN: 490-10474-1-ND; VOLTAGE: 10V
C11-C14 = daqcs_host:CAP: Chip Capacitor; MANUFACTURER: Murata; MANUFACTURER_PN: GQM1885C1H220JB01D; TEMP_COEFF: C0G; TOLERANCE: 5%; VENDOR: Digi-Key; VENDOR_PN: 490-3575-1-ND; VOLTAGE: 50V
C15 C16 = daqcs_host:CAP: Chip Capacitor; MANUFACTURER: Murata; MANUFACTURER_PN: GRM188R71H102KA01D; TEMP_COEFF: X7R; TOLERANCE: 10%; VENDOR: Digi-key; VENDOR_PN: 490-1494-1-ND; VOLTAGE: 50V
C19 C23 C24 C37 = daqcs_host:CAP: Chip Capacitor; MANUFACTURER: Murata; MANUFACTURER_PN: GRM033R61A105ME15D; TEMP_COEFF: X5R; TOLERANCE: 20%; VENDOR: Digi-key; VENDOR_PN: 490-13226-1-ND; VOLTAGE: 10V
C21 = daqcs_host:CAP: Chip Capacitor; MANUFACTURER: Murata; MANUFACTURER_PN: GRM188R61C225KE15D; TEMP_COEFF: X5R; TOLERANCE: 10%; VENDOR: Digi-key; VENDOR_PN: 490-3296-1-ND; VOLTAGE: 16V
C22 = daqcs_host:CAP: Chip Capacitor; MANUFACTURER: Murata; MANUFACTURER_PN: GRM188R61A475KE15D; TEMP_COEFF: X5R; TOLERANCE: 10%; VENDOR: Digi-key; VENDOR_PN: 490-10477-1-ND; VOLTAGE: 10V
C32-C34 = daqcs_host:CAP: Chip Capacitor; MANUFACTURER: AVX Corporation; MANUFACTURER_PN: 06035C103KAT4A; TEMP_COEFF: X7R; TOLERANCE: ±10%; VENDOR: Digi-key; VENDOR_PN: 478-10055-1-ND; VOLTAGE: 50V
DS1 = daqcs_host:LED: Chip LED; FORWARD_CURRENT: 20mA; FORWARD_VOLTAGE: 2.0V; MANUFACTURER: Wurth; MANUFACTURER_PN: 150060YS75000; VENDOR: Digi-key; VENDOR_PN: 732-4981-1-ND
DS2 DS4 DS6 = daqcs_host:LED: Chip LED; FORWARD_CURRENT: 20mA; FORWARD_VOLTAGE: 3.2V; MANUFACTURER: Wurth; MANUFACTURER_PN: 150060GS75000; VENDOR: Digi-key; VENDOR_PN: 732-4971-1-ND
DS3 DS5 DS7 = daqcs_host:LED: Chip LED; FORWARD_CURRENT: 20mA; FORWARD_VOLTAGE: 3.2V; MANUFACTURER: Wurth; MANUFACTURER_PN: 150060BS75000; VENDOR: Digi-key; VENDOR_PN: 732-4966-1-ND
H1-H4 = daqcs_host:MOUNT-HOLE: MOUNTING HOLE with drill center marker
J1-J4 J9 = daqcs_host:MOLSL_4PIN: Molex SL Series 4-Position Connector Wire to board 2.54 mm (.1 inch) pitch header (right-angle or vertical) Housing: Vendor=Molex, Vendor_PN=0050579404 22-24 AWG Crimp: Vendor=Molex, Vendor_PN=0016020087 Wires: AWG,Amps (Max) 22, 3.0 24, 3.0 26, 1.8 28, 1.2; FINISH: GOLD; LOCKING: YES; MANUFACTURER: Molex; MANUFACTURER_PN: 0705530003; MAX_CURRENT: 3.0A; MOUNT_ANGLE: RIGHT; MOUNT_TYPE: TH; POSITIONS: 4; VENDOR: Digi-key; VENDOR_PN: WM4902-ND
J5 = daqcs_host:MOLSL_5PIN: Molex SL Series 5-Position Connector Wire to board 2.54 mm (.1 inch) pitch header (right-angle or vertical) Housing: Vendor=Molex, Vendor_PN=0050579405 22-24 AWG Crimp: Vendor=Molex, Vendor_PN=0016020087 Wires: AWG,Amps (Max) 22, 3.0 24, 3.0 26, 1.8 28, 1.2; FINISH: GOLD; LOCKING: YES; MANUFACTURER: Molex; MANUFACTURER_PN: 0705530004; MAX_CURRENT: 3.0A; MOUNT_ANGLE: RIGHT; MOUNT_TYPE: TH; POSITIONS: 5; VENDOR: Digi-key; VENDOR_PN: WM4903-ND
J6 J10 = daqcs_host:MOLSL_3PIN: Molex SL Series 3-Position Connector Wire to board 2.54 mm (.1 inch) pitch header (right-angle or vertical) Housing: Vendor=Molex, Vendor_PN=0050579403 22-24 AWG Crimp: Vendor=Molex, Vendor_PN=0016020087 Wires: AWG,Amps (Max) 22, 3.0 24, 3.0 26, 1.8 28, 1.2; FINISH: GOLD; LOCKING: YES; MANUFACTURER: Molex; MANUFACTURER_PN: 0705430002; MAX_CURRENT: 3.0A; MOUNT_ANGLE: VERTICAL; MOUNT_TYPE: TH; POSITIONS: 3; VENDOR: Digi-key; VENDOR_PN: WM4801-ND
J7 = daqcs_host:MOLSL_5PIN: Molex SL Series 5-Position Connector Wire to board 2.54 mm (.1 inch) pitch header (right-angle or vertical) Housing: Vendor=Molex, Vendor_PN=0050579405 22-24 AWG Crimp: Vendor=Molex, Vendor_PN=0016020087 Wires: AWG,Amps (Max) 22, 3.0 24, 3.0 26, 1.8 28, 1.2; FINISH: GOLD; LOCKING: YES; MANUFACTURER: Molex; MANUFACTURER_PN: 0705430004; MAX_CURRENT: 3.0A; MOUNT_ANGLE: VERTICAL; MOUNT_TYPE: TH; POSITIONS: 5; VENDOR: Digi-key; VENDOR_PN: WM4803-ND
J8 = daqcs_host:MOLSL_3PIN: Molex SL Series 3-Position Connector Wire to board 2.54 mm (.1 inch) pitch header (right-angle or vertical) Housing: Vendor=Molex, Vendor_PN=0050579403 22-24 AWG Crimp: Vendor=Molex, Vendor_PN=0016020087 Wires: AWG,Amps (Max) 22, 3.0 24, 3.0 26, 1.8 28, 1.2; FINISH: GOLD; LOCKING: YES; MANUFACTURER: Molex; MANUFACTURER_PN: 0705530002; MAX_CURRENT: 3.0A; MOUNT_ANGLE: RIGHT; MOUNT_TYPE: TH; POSITIONS: 3; VENDOR: Digi-key; VENDOR_PN: WM4901-ND
J11 = daqcs_host:MOLSL_2PIN: Molex SL Series 2-Position Connector Wire to board 2.54 mm (.1 inch) pitch header (right-angle or vertical) Housing: Vendor=Molex, Vendor_PN=0050579402 22-24 AWG Crimp: Vendor=Molex, Vendor_PN=0016020087 Wires: AWG,Amps (Max) 22, 3.0 24, 3.0 26, 1.8 28, 1.2; FINISH: GOLD; LOCKING: YES; MANUFACTURER: Molex; MANUFACTURER_PN: 0705430001; MAX_CURRENT: 3.0A; MOUNT_ANGLE: VERTICAL; MOUNT_TYPE: TH; POSITIONS: 2; VENDOR: Digi-key; VENDOR_PN: WM4800-ND
J12 J19 = daqcs_host:M10X2: This was SPECIALLY designed to be used with our Graphic LCD Backpack. Be sure you want to use this! It is not only staggered on each line of header holes, but IT IS ALSO offset of the center point of the top and bottom lines by 5 mil. This causes the headers to lock into place on the "standard" footprint on the LCD screen. The extra squares on the tdocu layer are there simply to reference other pins (if you were to actually populate a longer header than ten long - this is what we do with the backpacks).; MANUFACTURER: Samtec Inc.; MANUFACTURER_PN: TSW-110-07-F-D; VENDOR: Digi-key; VENDOR_PN: SAM9002-ND
J13 J16 = daqcs_host:MOLSL_2PIN: Molex SL Series 2-Position Connector Wire to board 2.54 mm (.1 inch) pitch header (right-angle or vertical) Housing: Vendor=Molex, Vendor_PN=0050579402 22-24 AWG Crimp: Vendor=Molex, Vendor_PN=0016020087 Wires: AWG,Amps (Max) 22, 3.0 24, 3.0 26, 1.8 28, 1.2; FINISH: GOLD; LOCKING: YES; MANUFACTURER: Molex; MANUFACTURER_PN: 0705530001; MAX_CURRENT: 3.0A; MOUNT_ANGLE: RIGHT; MOUNT_TYPE: TH; POSITIONS: 2; VENDOR: Digi-key; VENDOR_PN: WM4900-ND
J14 = daqcs_host:USB: Description: 5 Pin USB Connectors. SLD is the shield connection. Usually tied to ground through a small ferrite bead.; CONTACTS: 5; MANUFACTURER: Amphenol; MANUFACTURER_PN: 10118193-0001LF; MOUNT_ANGLE: RIGHT; MOUNT_TYPE: TH/SMD; VENDOR: Digi-key; VENDOR_PN: 609-4616-1-ND
J17 = daqcs_host:CLM-112-02-L-D-IMU-MOUNT: MICRO SOCKET, 1.0MM, SMD, 2X12WAY; MANUFACTURER: SAMTEC; MANUFACTURER_PN: CLM-112-02-L-D; PACKAGE: MICRO SOCKET, 1.0MM, SMD, 2x12WAY; VENDOR: Digi-key; VENDOR_PN: SAM1129-12-ND
J18 = daqcs_host:MOLSL_7PIN: Molex SL Series 6-Position Connector Wire to board 2.54 mm (.1 inch) pitch header (right-angle or vertical) Housing: Vendor=Molex, Vendor_PN=0050579406 22-24 AWG Crimp: Vendor=Molex, Vendor_PN=0016020087 Wires: AWG,Amps (Max) 22, 3.0 24, 3.0 26, 1.8 28, 1.2; FINISH: Gold; LOCKING: Yes; MANUFACTURER: Molex; MANUFACTURER_PN: 70553-0111; MAX_CURRENT: 3.0A; MOUNT_ANGLE: Right; MOUNT_TYPE: TH; POSITIONS: 7; VENDOR: Digi-key; VENDOR_PN: WM4158-ND
L1 = daqcs_host:IND: Power Multilayer Inductor Characteristics Compact multilayer type Suitable for applications with high currents up to 2.7 A Smallest RDC-Values starting at 40 mΩ Magnetically shielded construction: No crosstalk Operating temperature: –40 °C to +125 °C Available in four sizes and three different types (Low Profile, Low RDC & High Saturation Current) Recommended soldering profile: Reflow Applications DC/DC converters especially at high switching frequencies > 1 MHz Electronic devices with very low profile Portable devices like Smart Phones, Tablets, Notebooks and Digital Cameras <http://katalog.we-online.de/media/images/eisos/IndPMI_pf2.jpgg> Details see: http://katalog.we-online.de/en/pbs/WE-PMI? Updated by Dan Xu 2014-07-08 2014 (C) Wurth Elektronik; CURRENT_RATING: 800mA; DC_RESTISTANCE: 238mOhm; MANUFACTURER: Murata; MANUFACTURER_PN: LQM21PN1R0MC0D; TOLERANCE: 20%; VENDOR: Digi-key; VENDOR_PN: 490-4992-1-ND
NC1-NC5 NC10-NC36 NC38-NC54 = daqcs_host:NO_CONNECT: No Connect
R1 R2 R9-R15 R20 R23 R24 R29 R44-R48 = daqcs_host:RES: Chip Resistor; MANUFACTURER: Panasonic; MANUFACTURER_PN: ERJ-3GEY0R00V; POWER: 1/10W; TOLERANCE: JUMPER; VENDOR: Digi-key; VENDOR_PN: P0.0GCT-ND
R3 R8 R16 R51 = daqcs_host:RES: Chip Resistor; MANUFACTURER: Panasonic; MANUFACTURER_PN: ERJ-3EKF4702V; POWER: 1/10W; TOLERANCE: 1%; VENDOR: Digi-key; VENDOR_PN: P47.0KHCT-ND
R4-R7 = daqcs_host:RES: Chip Resistor; MANUFACTURER: Panasonic; MANUFACTURER_PN: ERJ-3EKF2611V; POWER: 1/10W; TOLERANCE: 1%; VENDOR: Digi-key; VENDOR_PN: P2.61KHCT-ND
R17 = daqcs_host:RES: Chip Resistor; MANUFACTURER: Panasonic; MANUFACTURER_PN: ERJ-3EKF1003V; POWER: 1/10W; TOLERANCE: 1%; VENDOR: Digi-key; VENDOR_PN: P100KHCT-ND
R18 R19 R21 R26-R28 R42 R43 = daqcs_host:RES: Chip Resistor; MANUFACTURER: Panasonic; MANUFACTURER_PN: ERJ-3EKF2001V; POWER: 1/10W; TOLERANCE: 1%; VENDOR: Digi-key; VENDOR_PN: P2.00KHCT-ND
R22 = daqcs_host:RES: Chip Resistor; MANUFACTURER: Yageo; MANUFACTURER_PN: RL0603FR-070R4L; POWER: 1/10W; TOLERANCE: 1%; VENDOR: Digi-key; VENDOR_PN: 311-.4QCT-ND
R25 = daqcs:RES: Chip Resistor; MANUFACTURER: Panasonic; MANUFACTURER_PN: ERJ-3EKF1001V; POWER: 1/10W; TOLERANCE: 1%; VENDOR: Digi-key; VENDOR_PN: P1.00KHCT-ND
R30 R33 = daqcs_host:RES: Chip Resistor; MANUFACTURER: Panasonic; MANUFACTURER_PN: ERJ-3EKF10R2V; POWER: 1/10W; TOLERANCE: 1%; VENDOR: Digi-key; VENDOR_PN: P10.2HCT-ND
R31 = daqcs_host:RES: Chip Resistor; MANUFACTURER: Panasonic; MANUFACTURER_PN: ERJ-3EKF1072V; POWER: 1/10W; TOLERANCE: 1%; VENDOR: Digi-key; VENDOR_PN: P10.7KHCT-ND
R32 = daqcs_host:RES: Chip Resistor; MANUFACTURER: Panasonic; MANUFACTURER_PN: ERJ-3EKF4121V; POWER: 1/10W; TOLERANCE: 1%; VENDOR: Digi-key; VENDOR_PN: P4.12KHCT-ND
R34 R39 = daqcs_host:RES: Chip Resistor; MANUFACTURER: Panasonic; MANUFACTURER_PN: ERJ-3EKF1021V; POWER: 1/10W; TOLERANCE: 1%; VENDOR: Digi-key; VENDOR_PN: P1.02KHCT-ND
R35 = daqcs_host:RES: Chip Resistor; MANUFACTURER: Panasonic; MANUFACTURER_PN: ERJ-3EKF6812V; POWER: 1/10W; TOLERANCE: 1%; VENDOR: Digi-key; VENDOR_PN: P68.1KHCT-ND
R36 = daqcs_host:RES: Chip Resistor; MANUFACTURER: Panasonic; MANUFACTURER_PN: ERJ-3EKF7501V; POWER: 1/10W; TOLERANCE: 1%; VENDOR: Digi-key; VENDOR_PN: P7.50KHCT-ND
R37 = daqcs_host:RES: Chip Resistor; MANUFACTURER: Panasonic; MANUFACTURER_PN: ERJ-3EKF1371V; POWER: 1/10W; TOLERANCE: 1%; VENDOR: Digi-key; VENDOR_PN: P1.37KHCT-ND
R38 = daqcs_host:RES: Chip Resistor; MANUFACTURER: Panasonic; MANUFACTURER_PN: ERJ-3EKF1871V; POWER: 1/10W; TOLERANCE: 1%; VENDOR: Digi-key; VENDOR_PN: P1.87KHCT-ND
R40 = daqcs_host:RES: Chip Resistor; MANUFACTURER: Panasonic; MANUFACTURER_PN: ERJ-3EKF4321V; POWER: 1/10W; TOLERANCE: 1%; VENDOR: Digi-key; VENDOR_PN: P4.32KHCT-ND
R41 = daqcs_host:RES: Chip Resistor; MANUFACTURER: Panasonic; MANUFACTURER_PN: ERJ-3EKF1501V; POWER: 1/10W; TOLERANCE: 1%; VENDOR: Digi-key; VENDOR_PN: P1.50KHCT-ND
R49 R50 = daqcs_host:RES: Chip Resistor; MANUFACTURER: Panasonic; MANUFACTURER_PN: ERJ-3EKF49R9V; POWER: 1/10W; TOLERANCE: 1%; VENDOR: Digi-key; VENDOR_PN: P49.9HCT-ND
R52-R71 = daqcs_host:RES: Chip Resistor; MANUFACTURER: Panasonic; MANUFACTURER_PN: ERJ-3EKF23R2V; POWER: 1/10W; TOLERANCE: 1%; VENDOR: Digi-key; VENDOR_PN: P23.2HCT-ND
R72 = daqcs_host:RES: Chip Resistor; MANUFACTURER: Panasonic; MANUFACTURER_PN: ERJ-3EKF4992V; POWER: 1/10W; TOLERANCE: 1%; VENDOR: Digi-key; VENDOR_PN: P49.9KHCT-ND
S1 S2 = daqcs_host:SWITCH-MOMENTARY-2: Various NO switches- pushbuttons, reed, etc; MANUFACTURER: Omron Electronics; MANUFACTURER_PN: B3F-1000; PROD_ID: SWCH-08441; VENDOR: Digi-key; VENDOR_PN: SW400-ND
TP1-TP44 = daqcs_host:TEST_POINT: Test Point (various sizes)
U1 U2 = daqcs_host:MSP430FR5994IPNR; MANUFACTURER: Texas Instruments; MANUFACTURER_PN: MSP430FR5994IPNR; REFDES: RefDes; TYPE: TYPE
U3 = daqcs_host:PCT2075: I2C-bus Fm+, 1 degree C accuracy, digital temperature sensor and thermal watchdog; INTERFACE: I2C; MANUFACTURER: NXP; MANUFACTURER_PN: PCT2075D,118; RESOLUTION: 10b; VENDOR: Digi-key; VENDOR_PN: 568-10219-1-ND
U4 = daqcs_host:MS5607: Barometric Pressure Sensor, with stainless steel cap Specs High resolution module, 20cm Fast conversion down to 1 ms Low power, 1 μA (standby < 0.15 μA) QFN package 5.0 x 3.0 x 1.0 mm3 Supply voltage 1.8 to 3.6 V Integrated digital pressure sensor (24 bit ΔΣ ADC) Operating range: 10 to 1200 mbar, -40 to +85 °C I2C and SPI interface up to 20 MHz No external components (Internal oscillator) Excellent long term stability; INTERFACE: I2C,SPI; MANUFACTURER: TE Connectivity; MANUFACTURER_PN: MS560702BA03-50; OUTPUT_BITS: 24b; PRESSURE_TYPE: Absolute; VENDOR: Digi-key; VENDOR_PN: 223-1198-1-ND
U5 = daqcs_host:TPS61240DRVR: 3.5-MHz High Efficiency Step-Up Converter; MANUFACTURER: Texas Instruments; MANUFACTURER_PN: TPS61240DRVR; OC_FARNELL: -; OC_NEWARK: 25R0113; PACKAGE: SON-6; VENDOR: Digi-key; VENDOR_PN: 296-39437-1-ND
U6 = daqcs_host:LP5907_DBV_5; IOUT: 250mA; MANUFACTURER: Texas Instruments; MANUFACTURER_PN: lp5907_dbv_5; VENDOR: Digi-key; VENDOR_PN: 296-38557-1-ND; VIN: 5.5V; VOUT: +3V3
U7 = daqcs_host:MCP73831: IC, BATT CHARGER, Li-Ion Li-Polymer, 500 mA; MANUFACTURER: Microchip; MANUFACTURER_PN: MCP73831T-2ATI/OT; VENDOR: Digi-key; VENDOR_PN: MCP73831T-2ATI/OTCT-ND
U8 = daqcs_host:INA219: 26-V, Bidirectional, Zero-Drift, High-Side, I2C Out Current/Power Monitor; MANUFACTURER: Texas Instruments; MANUFACTURER_PN: INA219AIDCNR; VENDOR: Digi-key; VENDOR_PN: 296-23770-1-ND
U10 = daqcs_host:LSM9DS1: LSM9DS1 3D accelerometer, gyroscope & magnetometer The LSM9DS1 is a system-in-package featuring a 3D digital linear acceleration sensor, a 3D digital angular rate sensor, and a 3D digital magnetic sensor. The LSM9DS1 has a linear acceleration full scale of ±2g/±4g/±8/±16 g, a magnetic field full scale of ±4/±8/±12/±16 gauss and an angular rate of ±245/±500/±2000 dps. The LSM9DS1 includes an I2 C serial bus interface supporting standard and fast mode (100 kHz and 400 kHz) and an SPI serial standard interface. Magnetic, accelerometer and gyroscope sensing can be enabled or set in power-down mode separately for smart power management. The LSM9DS1 is available in a plastic land grid array package (LGA) and it is guaranteed to operate over an extended temperature range from -40 °C to +85 °C.; MANUFACTURER: STMicroelectronics; MANUFACTURER_PN: LSM9DS1TR; PROD_ID: IC-12536; VENDOR: Digi-key; VENDOR_PN: 497-14946-1-ND
U$1 = daqcs_host:MICROSD: Micro-SD / Transflash card holder with SPI pinout For the 3M # 2908-05WB-MG and/or 4UCON #19656 push-push type; MANUFACTURER: 3M; MANUFACTURER_PN: 2908-05WB-MG; VENDOR: Digi-key; VENDOR_PN: 3M5607CT-ND
U$4 U$5 = daqcs_host:ASEMB-24MHZ-XY-T; FREQUENCY: 24MHz; MANUFACTURER: Abracon LLC; MANUFACTURER_PN: ASEMB-24.000MHZ-XY-T; VENDOR: Digi-key; VENDOR_PN: 535-11123-1-ND
U$6 = daqcs_host:TCLD1000; MANUFACTURER: Vishay Semiconductor; MANUFACTURER_PN: TCLD1000; VENDOR: Digi-key; VENDOR_PN: TCLD1000CT-ND
Y1 Y3 = daqcs_host:CRYSTAL: Various standard crystals. Proven footprints.; FREQUENCY: 32.768kHz; LOAD_CAP: 12.5pF; MANUFACTURER: Epson; MANUFACTURER_PN: FC-135R; TOLERANCE: 20ppm; VENDOR: Digi-key; VENDOR_PN: SER4071CT-ND
Z1-Z6 = daqcs_host:MMSZ5225BT1G; MANUFACTURER: ON Semiconductor; MANUFACTURER_PN: MMSZ5225BT1G; VENDOR: Digi-key; VENDOR_PN: MMSZ5225BT1GOSCT-ND
Z7 = daqcs_host:NTD2955T4G; MANUFACTURER: ON Semiconductor; MANUFACTURER_PN: NTD2955T4G; VENDOR: Digi-key; VENDOR_PN: NTD2955T4GOSCT-ND